# EAGLE design HP85disk (EAGLE 9.2.2)

## Sheet 1 of 2
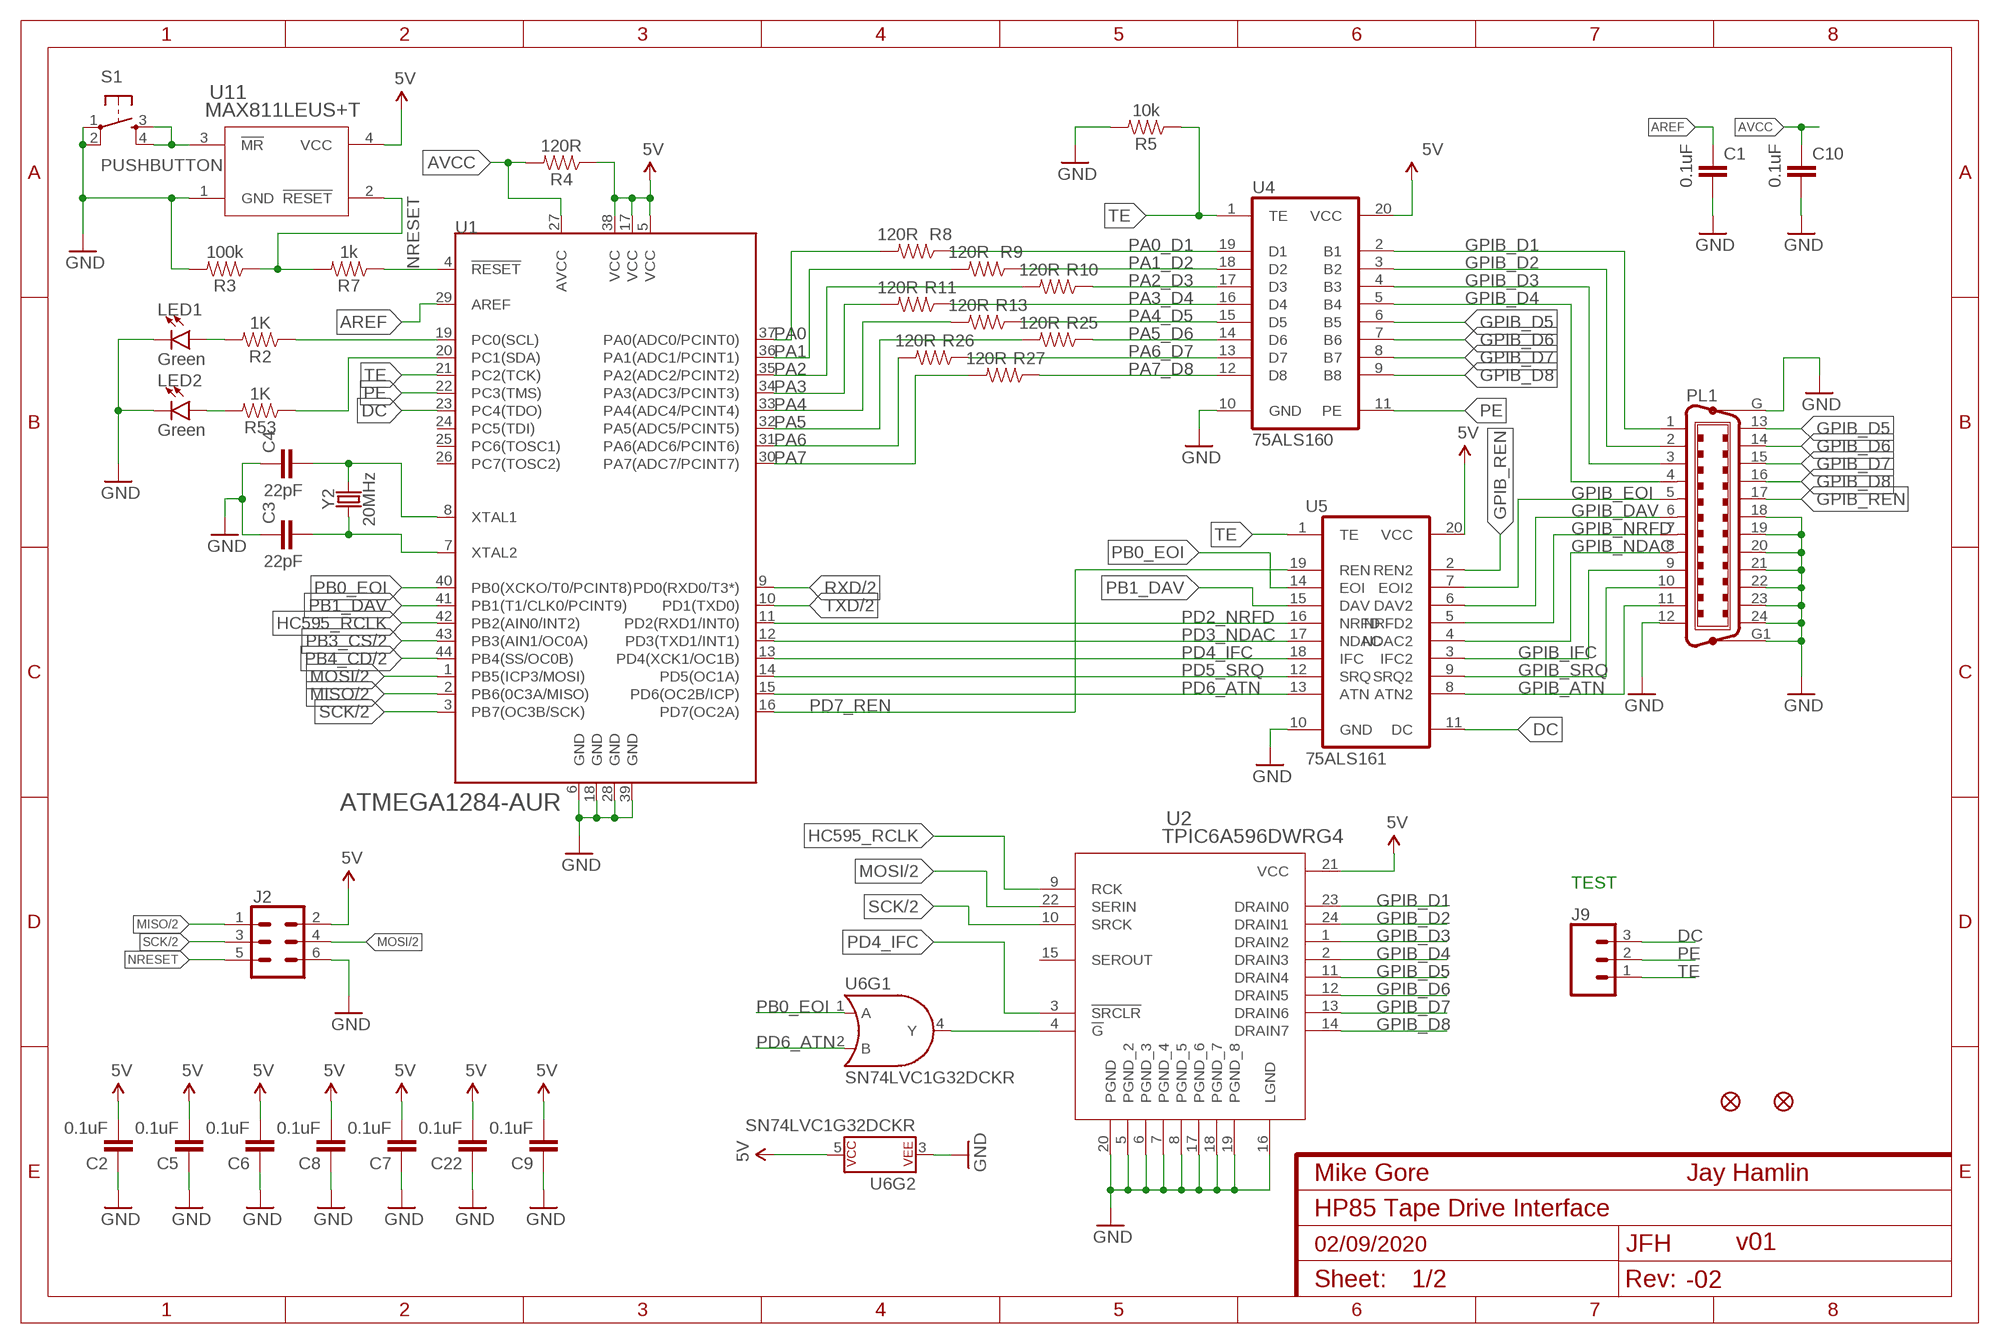
[diagram p0: schematic, sheet 1]

### Parts
C1  0.1uF  0.1UF-0603-25V-(+80/-20%)  [0603]
C2  0.1uF  0.1UF-0603-25V-(+80/-20%)  [0603]
C3  22pF  0.1UF-0603-25V-(+80/-20%)  [0603]
C4  22pF  0.1UF-0603-25V-(+80/-20%)  [0603]
C5  0.1uF  0.1UF-0603-25V-(+80/-20%)  [0603]
C6  0.1uF  0.1UF-0603-25V-(+80/-20%)  [0603]
C7  0.1uF  0.1UF-0603-25V-(+80/-20%)  [0603]
C8  0.1uF  0.1UF-0603-25V-(+80/-20%)  [0603]
C9  0.1uF  0.1UF-0603-25V-(+80/-20%)  [0603]
C10  0.1uF  0.1UF-0603-25V-(+80/-20%)  [0603]
C22  0.1uF  0.1UF-0603-25V-(+80/-20%)  [0603]
J2  CONN_03X2_BIGPADSFEMALE_SMD  [2X3_SMD]
J9  CONN_03  [1X03]
JP8  FIDUCIAL1X2  [FIDUCIAL-1X2]
JP9  FIDUCIAL1X2  [FIDUCIAL-1X2]
LED1  Green  LED1206  [LED-1206]
LED2  Green  LED1206  [LED-1206]
PL1  C24HP  [24HP]
R2  1K  4.7KOHM-0603-1/10W-1%  [0603]
R3  100k  10KOHM-0603-1/10W-1%  [0603]
R4  120R  10KOHM-0603-1/10W-1%  [0603]
R5  10k  10KOHM-0603-1/10W-1%  [0603]
R7  1k  10KOHM-0603-1/10W-1%  [0603]
R8  120R  10KOHM-0603-1/10W-1%  [0603]
R9  120R  10KOHM-0603-1/10W-1%  [0603]
R10  120R  10KOHM-0603-1/10W-1%  [0603]
R11  120R  10KOHM-0603-1/10W-1%  [0603]
R13  120R  10KOHM-0603-1/10W-1%  [0603]
R25  120R  10KOHM-0603-1/10W-1%  [0603]
R26  120R  10KOHM-0603-1/10W-1%  [0603]
R27  120R  10KOHM-0603-1/10W-1%  [0603]
R53  1K  4.7KOHM-0603-1/10W-1%  [0603]
S1  PUSHBUTTON  SWITCH_SPST_4_PINSQUARE  [TACTILE-SWITCH-SMD]
U1  ATMEGA1284-AUR  ATMEGA1284AUTQFP-44  [TQFP44]
U2  TPIC6A596DWRG4  [DW24]
U4  75ALS160  75160SO  [SO20L]
U5  75ALS161  75161SO  [SO20L]
U6  SN74LVC1G32DCKR  74LVC32DBV  [SOT23-5]
U11  MAX811LEUS+T  MAX811TEUS+T  [21-0052F]
Y2  20MHz  CRYSTAL-16MHZSMD-5X3.2  [CRYSTAL-SMD-5X3.2-4PAD]

### Nets
5V: C2.2 C5.2 C6.2 C7.2 C8.2 C9.2 C22.2 J2.2 R4.1 U1.5(VCC) U1.17(VCC) U1.38(VCC) U2.21(VCC) U4.20(VCC) U5.20(VCC) U6.5(P$V+) U11.4(VCC) ; also sheet 2
AREF: C1.1 U1.29(AREF)
AVCC: C10.1 R4.2 U1.27(AVCC)
DC: J9.3 U1.23(PC4(TDO)) U5.11(DC)
GND: C1.2 C2.1 C3.1 C4.1 C5.1 C6.1 C7.1 C8.1 C9.1 C10.2 C22.1 J2.6 LED1.C LED2.C PL1.12 PL1.18 PL1.19 PL1.20 PL1.21 PL1.22 PL1.23 PL1.24 PL1.G PL1.G1 R3.2 R5.2 S1.1 S1.2 U1.6(GND) U1.18(GND) U1.28(GND) U1.39(GND) U2.5(PGND_2) U2.6(PGND_3) U2.7(PGND_4) U2.8(PGND_5) U2.16(LGND) U2.17(PGND_6) U2.18(PGND_7) U2.19(PGND_8) U2.20(PGND) U4.10(GND) U5.10(GND) U6.3(P$V-) U11.1(GND) ; also sheet 2
GPIB_ATN: PL1.11 U5.8(ATN2)
GPIB_D1: PL1.1 U2.23(DRAIN0) U4.2(B1)
GPIB_D2: PL1.2 U2.24(DRAIN1) U4.3(B2)
GPIB_D3: PL1.3 U2.1(DRAIN2) U4.4(B3)
GPIB_D4: PL1.4 U2.2(DRAIN3) U4.5(B4)
GPIB_D5: PL1.13 U2.11(DRAIN4) U4.6(B5)
GPIB_D6: PL1.14 U2.12(DRAIN5) U4.7(B6)
GPIB_D7: PL1.15 U2.13(DRAIN6) U4.8(B7)
GPIB_D8: PL1.16 U2.14(DRAIN7) U4.9(B8)
GPIB_DAV: PL1.6 U5.6(DAV2)
GPIB_EOI: PL1.5 U5.7(EOI2)
GPIB_IFC: PL1.9 U5.3(IFC2)
GPIB_NDAC: PL1.8 U5.4(NDAC2)
GPIB_NRFD: PL1.7 U5.5(NRFD2)
GPIB_REN: PL1.17 U5.2(REN2)
GPIB_SRQ: PL1.10 U5.9(SRQ2)
HC595_RCLK: U1.42(PB2(AIN0/INT2)) U2.9(RCK)
MISO: J2.1 U1.2(PB6(0C3A/MISO)) ; also sheet 2
MOSI: J2.4 U1.1(PB5(ICP3/MOSI)) U2.22(SERIN) ; also sheet 2
N$2: R53.1 U1.20(PC1(SDA))
N$3: C4.2 U1.8(XTAL1) Y2.3
N$4: C3.2 U1.7(XTAL2) Y2.1
N$6: U2.4(!G) U6.4(Y)
N$8: S1.3 S1.4 U11.3(!MR)
N$12: R3.1 R7.2 U11.2(!RESET)
N$21: LED1.A R2.2
N$22: LED2.A R53.2
N$28: R2.1 U1.19(PC0(SCL))
NRESET: J2.5 R7.1 U1.4(!RESET)
PA0: R8.2 U1.37(PA0(ADC0/PCINT0))
PA0_D1: R8.1 U4.19(D1)
PA1: R9.2 U1.36(PA1(ADC1/PCINT1))
PA1_D2: R9.1 U4.18(D2)
PA2: R10.2 U1.35(PA2(ADC2/PCINT2))
PA2_D3: R10.1 U4.17(D3)
PA3: R11.2 U1.34(PA3(ADC3/PCINT3))
PA3_D4: R11.1 U4.16(D4)
PA4: R13.2 U1.33(PA4(ADC4/PCINT4))
PA4_D5: R13.1 U4.15(D5)
PA5: R25.2 U1.32(PA5(ADC5/PCINT5))
PA5_D6: R25.1 U4.14(D6)
PA6: R26.2 U1.31(PA6(ADC6/PCINT6))
PA6_D7: R26.1 U4.13(D7)
PA7: R27.2 U1.30(PA7(ADC7/PCINT7))
PA7_D8: R27.1 U4.12(D8)
PB0_EOI: U1.40(PB0(XCKO/T0/PCINT8)) U5.14(EOI) U6.1(A)
PB1_DAV: U1.41(PB1(T1/CLK0/PCINT9)) U5.15(DAV)
PB3_CS: U1.43(PB3(AIN1/OC0A)) ; also sheet 2
PB4_CD: U1.44(PB4(SS/OC0B)) ; also sheet 2
PD2_NRFD: U1.11(PD2(RXD1/INT0)) U5.16(NRFD)
PD3_NDAC: U1.12(PD3(TXD1/INT1)) U5.17(NDAC)
PD4_IFC: U1.13(PD4(XCK1/OC1B)) U2.3(!SRCLR) U5.18(IFC)
PD5_SRQ: U1.14(PD5(OC1A)) U5.12(SRQ)
PD6_ATN: U1.15(PD6(OC2B/ICP)) U5.13(ATN) U6.2(B)
PD7_REN: U1.16(PD7(OC2A)) U5.19(REN)
PE: J9.2 U1.22(PC3(TMS)) U4.11(PE)
RXD: U1.9(PD0(RXD0/T3*)) ; also sheet 2
SCK: J2.3 U1.3(PB7(OC3B/SCK)) U2.10(SRCK) ; also sheet 2
TE: J9.1 R5.1 U1.21(PC2(TCK)) U4.1(TE) U5.1(TE)
TXD: U1.10(PD1(TXD0)) ; also sheet 2
Unconnected: U1.24(PC5(TDI)) U1.25(PC6(TOSC1)) U1.26(PC7(TOSC2)) U2.15(SEROUT)

### Notes on the sheet
- TEST
- v01

## Sheet 2 of 2
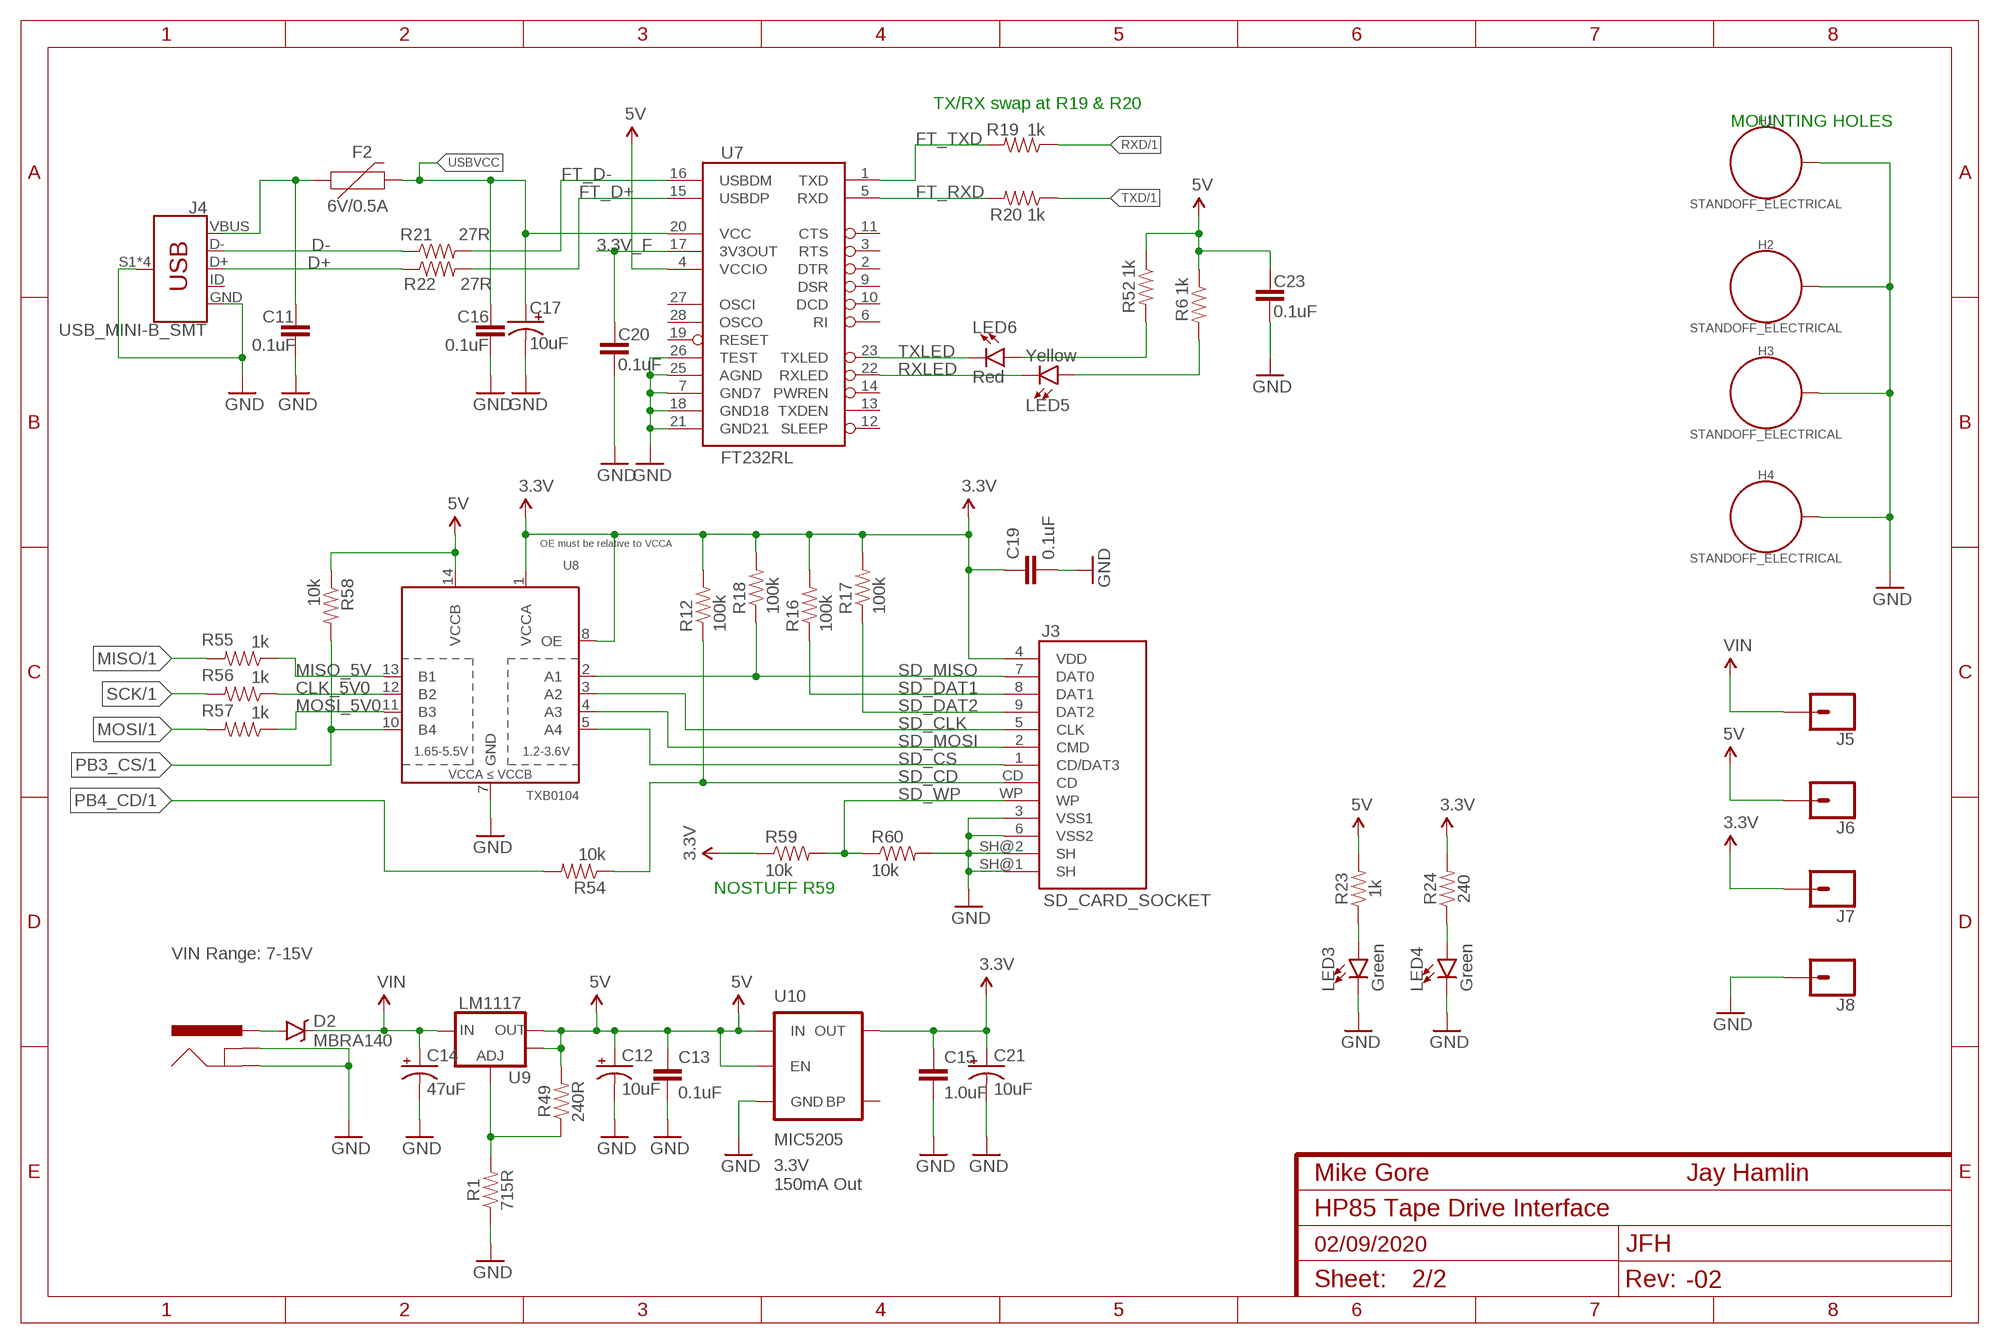
[diagram p1: schematic, sheet 2]

### Parts
C11  0.1uF  0.1UF-0603-25V-(+80/-20%)  [0603]
C12  10uF  10UF-POLAR-EIA3216-16V-10%(TANT)  [EIA3216]
C13  0.1uF  0.1UF-0603-25V-(+80/-20%)  [0603]
C14  47uF  47UF-POLAR-PANASONIC_D-35V-20%  [PANASONIC_D]
C15  1.0uF  1.0UF-0603-16V-10%  [0603]
C16  0.1uF  0.1UF-0603-25V-(+80/-20%)  [0603]
C17  10uF  10UF-POLAR-EIA3216-16V-10%(TANT)  [EIA3216]
C19  0.1uF  0.1UF-0603-25V-(+80/-20%)  [0603]
C20  0.1uF  0.1UF-0603-25V-(+80/-20%)  [0603]
C21  10uF  10UF-POLAR-EIA3216-16V-10%(TANT)  [EIA3216]
C23  0.1uF  0.1UF-0603-25V-(+80/-20%)  [0603]
D2  MBRA140  [SMA-DIODE]
F2  6V/0.5A  PTC-HALF_AMP  [1206]
H1  STANDOFF_ELECTRICAL  [STANDOFF-ELECTRICAL]
H2  STANDOFF_ELECTRICAL  [STANDOFF-ELECTRICAL]
H3  STANDOFF_ELECTRICAL  [STANDOFF-ELECTRICAL]
H4  STANDOFF_ELECTRICAL  [STANDOFF-ELECTRICAL]
J1  POWER_JACKSUPER_BOMB_DIGITY  [POWER_JACK_SMD_OVERPASTE_SUPER_BOMB_DIGITY]
J3  SD_CARD_SOCKET  [SD_1:1]
J4  USB_MINI-B_SMT  [USB-MINIB]
J5  CONN_01  [1X01]
J6  CONN_01  [1X01]
J7  CONN_01  [1X01]
J8  CONN_01  [1X01]
LED3  Green  LED1206  [LED-1206]
LED4  Green  LED1206  [LED-1206]
LED5  Yellow  LED1206  [LED-1206]
LED6  Red  LED1206  [LED-1206]
R1  715R  715OHM-0603-1/10W-1%  [0603]
R6  1k  1KOHM-0603-1/10W-1%  [0603]
R12  100k  100KOHM-1/10W-1%(0603)  [0603-RES]
R16  100k  100KOHM-1/10W-1%(0603)  [0603-RES]
R17  100k  100KOHM-1/10W-1%(0603)  [0603-RES]
R18  100k  100KOHM-1/10W-1%(0603)  [0603-RES]
R19  1k  1KOHM-0603-1/10W-1%  [0603]
R20  1k  1KOHM-0603-1/10W-1%  [0603]
R21  27R  27OHM-0603-1/10W-1%  [0603]
R22  27R  27OHM-0603-1/10W-1%  [0603]
R23  1k  4.7KOHM-0603-1/10W-1%  [0603]
R24  240  4.7KOHM-0603-1/10W-1%  [0603]
R49  240R  240OHM-0603-1/10W-1%  [0603]
R52  1k  1KOHM-0603-1/10W-1%  [0603]
R54  10k  100KOHM-1/10W-1%(0603)  [0603-RES]
R55  1k  100KOHM-1/10W-1%(0603)  [0603-RES]
R56  1k  100KOHM-1/10W-1%(0603)  [0603-RES]
R57  1k  100KOHM-1/10W-1%(0603)  [0603-RES]
R58  10k  100KOHM-1/10W-1%(0603)  [0603-RES]
R59  10k  100KOHM-1/10W-1%(0603)  [0603-RES]
R60  10k  100KOHM-1/10W-1%(0603)  [0603-RES]
U7  FT232RL  FT232RLSSOP  [SSOP28DB]
U8  TXB0104  TXB0104PWRSOIC14  [SO14]
U9  LM1117  V_REG_LM1117ALT1  [SOT223-ALT1]
U10  MIC5205  MIC52053.3V  [SOT23-5]

### Nets
3.3V: C15.1 C19.1 C21.+ J3.4(VDD) J7.1 R12.2 R16.2 R17.2 R18.2 R24.2 R59.1 U8.1(VCCA) U8.8(OE) U10.5(OUT)
3.3V_F: C20.1 U7.17(3V3OUT)
5V: C12.+ C13.1 C23.1 J6.1 R6.1 R23.2 R49.2 R52.1 R58.1 U7.4(VCCIO) U8.14(VCCB) U9.2(OUT) U9.4(OUT) U10.1(IN) U10.3(EN) ; also sheet 1
CLK_5V0: R56.1 U8.12(B2)
D+: J4.D+ R22.1
D-: J4.D- R21.1
FT_D+: R22.2 U7.15(USBDP)
FT_D-: R21.2 U7.16(USBDM)
FT_RXD: R20.2 U7.5(RXD)
FT_TXD: R19.2 U7.1(TXD)
GND: C11.2 C12.- C13.2 C14.- C15.2 C16.2 C17.- C19.2 C20.2 C21.- C23.2 H1.P1 H2.P1 H3.P1 H4.P1 J1.GND(GNDBREAK) J1.P$4(GND) J3.3(VSS1) J3.6(VSS2) J3.SH@1(SH) J3.SH@2(SH) J4.GND J4.S1(SHIELD) J4.S2(SHIELD) J4.S3(SHIELD) J4.S4(SHIELD) J8.1 LED3.C LED4.C R1.1 R60.2 U7.7(GND7) U7.18(GND18) U7.21(GND21) U7.25(AGND) U7.26(TEST) U8.7(GND) U10.2(GND) ; also sheet 1
MISO: R55.2 ; also sheet 1
MISO_5V: R55.1 U8.13(B1)
MOSI: R57.2 ; also sheet 1
MOSI_5V0: R57.1 U8.11(B3)
N$1: R1.2 R49.1 U9.1(ADJ)
N$5: LED6.A R52.2
N$7: LED3.A R23.1
N$9: LED5.A R6.2
N$19: LED4.A R24.1
PB3_CS: R58.2 U8.10(B4) ; also sheet 1
PB4_CD: R54.2 ; also sheet 1
PWRIN1: D2.A J1.VIN0(PWR)
RXD: R19.1 ; also sheet 1
RXLED: LED5.C U7.22(RXLED)
SCK: R56.2 ; also sheet 1
SD_CD: J3.CD R12.1 R54.1
SD_CLK: J3.5(CLK) U8.3(A2)
SD_CS: J3.1(CD/DAT3) U8.5(A4)
SD_DAT1: J3.8(DAT1) R16.1
SD_DAT2: J3.9(DAT2) R17.1
SD_MISO: J3.7(DAT0) R18.1 U8.2(A1)
SD_MOSI: J3.2(CMD) U8.4(A3)
SD_WP: J3.WP R59.2 R60.1
TXD: R20.1 ; also sheet 1
TXLED: LED6.C U7.23(TXLED)
USBVCC: C16.1 C17.+ F2.2 U7.20(VCC)
VIN: C14.+ D2.C J5.1 U9.3(IN)
VUSB1: C11.1 F2.1 J4.VBUS
Unconnected: J4.ID U7.2(DTR) U7.3(RTS) U7.6(RI) U7.9(DSR) U7.10(DCD) U7.11(CTS) U7.12(SLEEP) U7.13(TXDEN) U7.14(PWREN) U7.19(RESET) U7.27(OSCI) U7.28(OSCO) U10.4(BP)

### Notes on the sheet
- TX/RX swap at R19 & R20
- MOUNTING HOLES
- OE must be relative to VCCA
- NOSTUFF R59
- VIN Range: 7-15V
- 3.3V
  150mA Out

## Library data of the parts
C1 C9-C11 C13 C16 C19 C20 C22 C23 = SparkFun-Capacitors:0.1UF: 0.1µF ceramic capacitors A capacitor is a passive two-terminal electrical component used to store electrical energy temporarily in an electric field.; PROD_ID: CAP-00810
C2 C5-C8 = SparkFun-Capacitors:0.1UF: 0.1µF ceramic capacitors A capacitor is a passive two-terminal electrical component used to store electrical energy temporarily in an electric field.; PROD_ID: CAP-00810; SPICEPREFIX: C
C3 C4 = SparkFun-Capacitors:0.1UF: 0.1µF ceramic capacitors A capacitor is a passive two-terminal electrical component used to store electrical energy temporarily in an electric field.; PROD_ID: CAP-00810; VALUE: 0.1uF
C12 C17 C21 = SparkFun-Capacitors:10UF-POLAR: 10.0µF polarized capacitors A capacitor is a passive two-terminal electrical component used to store electrical energy temporarily in an electric field.; PROD_ID: CAP-00811
C14 = SparkFun-Capacitors:47UF-POLAR: 47µF polarized capacitors A capacitor is a passive two-terminal electrical component used to store electrical energy temporarily in an electric field.; PROD_ID: CAP-08478
C15 = SparkFun-Capacitors:1.0UF: 1µF ceramic capacitors A capacitor is a passive two-terminal electrical component used to store electrical energy temporarily in an electric field.; PROD_ID: CAP-00868
D2 = SparkFun-DiscreteSemi:MBRA140: 40V, 1A Schottky rectifier SMA/DO-214AC package DIO-08053; PROD_ID: DIO-08053
F2 = SparkFun-Fuses:PTC: Resettable Fuse PTC Resettable Fuse. Really a resistor with a postive temperature coefficient who's resistance increases dramatically with an increase in temperature. When heated by the power passing through the resistance rises causing the current to be limited, protecting the circuit. When a PTC cools back down it resumes conducting letting the circuit turn back on.; PROD_ID: RES-08585
H1-H4 = SparkFun-Hardware:STANDOFF_ELECTRICAL: Stand Off Drill holes with an electrical connection. For example, use these to ground your board to a chassis. Example SparkFun Products Screw - Phillips Head (1/4", 4-40, 10 pack) <https://www.sparkfun.com/products/10453> (PRT-10453) Screw - Phillips Head (1/2", 4-40, 10 pack) <https://www.sparkfun.com/products/10452> (PRT-10452) Screw - Phillips Head (3/4", 4-40, 10 pack) <https://www.sparkfun.com/products/10451> (PRT-10451) Screw - Phillips Head (1", 4-40, 10 pack) <https://www.sparkfun.com/products/10450> (PRT-10450)
J1 = Testing:POWER_JACK: Power Jack This is the standard 5.5mm barrel jack for power. The PTH is the most common, proven, reliable, footprint. All others are experimental. The Slot footprint only works if the mill layer is transmitted to the PCB fab house so be warned. Spark Fun Electronics SKU : PRT-00119. Mating wall wart : TOL-00298 (and others); PROD_ID: CONN-08106
J2 = JaysOWL_Library:CONN_03X2_BIGPADS: Multi connection point. Often used as Generic Header-pin footprint for 0.1 inch spaced/style header connections You can populate with any combo of single row headers, but if you'd like an exact match, check these: Header - 2x3 (Male, 0.1") <https://www.sparkfun.com/products/12807> (PRT-12807) Header - 2x3 (Female, 0.1") <https://www.sparkfun.com/products/13010> (PRT-13010) 2x3 Pin Shrouded Header <https://www.sparkfun.com/products/10877> (PRT-10877) On any of the 0.1 inch spaced packages, you can populate with these: Break Away Headers - Straight <https://www.sparkfun.com/products/116> (PRT-00116) Break Away Male Headers - Right Angle <https://www.sparkfun.com/products/553> (PRT-00553) Female Headers <https://www.sparkfun.com/products/115> (PRT-00115) Break Away Headers - Machine Pin <https://www.sparkfun.com/products/117> (PRT-00117) Break Away Female Headers - Swiss Machine Pin <https://www.sparkfun.com/products/743> (PRT-00743) Special note: the shrouded connector mates well with our 3x2 ribbon cables: Ribbon Crimp Connector - 6-pin (2x3, Female) <https://www.sparkfun.com/products/10651> (PRT-10651) Ribbon Cable - 6 wire (15ft) <https://www.sparkfun.com/products/10646> (PRT-10646); PROD_ID: CONN-11290
J3 = SparkFun-Connectors:SD_CARD_SOCKET: SD Memory Card Connector, push-push normal type, CD enable, WP enable
J4 = JaysOWL_Library:USB_MINI-B: USB type Mini-B Connector Breaks out 5th pin, and includes shield pins if needed. SparkFun Products: SparkFun FTDI Basic Breakout <https://www.sparkfun.com/products/9716> SparkFun XBee Explorer USB <https://www.sparkfun.com/products/11812> SparkFun Redboard <https://www.sparkfun.com/products/12757>; PROD_ID: CONN-08193; SF_ID: PRT-00587
J5-J8 = SparkFun-Connectors:CONN_01: Single connection point. Often used as Generic Header-pin footprint for 0.1 inch spaced/style header connections On any of the 0.1 inch spaced packages, you can populate with these: Break Away Headers - Straight <https://www.sparkfun.com/products/116> (PRT-00116) Break Away Male Headers - Right Angle <https://www.sparkfun.com/products/553> (PRT-00553) Female Headers <https://www.sparkfun.com/products/115> (PRT-00115) Break Away Headers - Machine Pin <https://www.sparkfun.com/products/117> (PRT-00117) Break Away Female Headers - Swiss Machine Pin <https://www.sparkfun.com/products/743> (PRT-00743) This device is also useful as a general connection point to wire up your design to another part of your project. Our various solder wires solder well into these plated through hole pads. Hook-Up Wire - Assortment (Stranded, 22 AWG) <https://www.sparkfun.com/products/11375> (PRT-11375) Hook-Up Wire - Assortment (Solid Core, 22 AWG) <https://www.sparkfun.com/products/11367> (PRT-11367) View the entire wire category on our website here <https://www.sparkfun.com/categories/141> Special notes: SMTSO-256-ET is a "flush mount" nut for a 4-40 screw. We mostly use this on specialty testbeds; it is a nice way to connect hardware to your PCB at an adjustable hieght. Also note, the SNAP packages are for using a snappable style connector. We sell a baggie of snaps and they are also used on two LilyPad designs: Snap Assortment - 30 pack (male and female) <https://www.sparkfun.com/products/11347> (DEV-11347) LilyPad Arduino SimpleSnap <https://www.sparkfun.com/products/10941> (DEV-10941) LilyPad SimpleSnap Protoboard <https://www.sparkfun.com/products/10940> (DEV-10940)
J9 = SparkFun-Connectors:CONN_03: Multi connection point. Often used as Generic Header-pin footprint for 0.1 inch spaced/style header connections On any of the 0.1 inch spaced packages, you can populate with these: Break Away Headers - Straight <https://www.sparkfun.com/products/116> (PRT-00116) Break Away Male Headers - Right Angle <https://www.sparkfun.com/products/553> (PRT-00553) Female Headers <https://www.sparkfun.com/products/115> (PRT-00115) Break Away Headers - Machine Pin <https://www.sparkfun.com/products/117> (PRT-00117) Break Away Female Headers - Swiss Machine Pin <https://www.sparkfun.com/products/743> (PRT-00743) Stackable Header - 3 Pin (Female, 0.1") <https://www.sparkfun.com/products/13875> (PRT-13875) For SCREWTERMINALS and SPRING TERMINALS visit here: Screw Terimnals on SparkFun.com <https://www.sparkfun.com/search/results?term=Screw+Terminals> (5mm/3.5mm/2.54mm spacing) This device is also useful as a general connection point to wire up your design to another part of your project. Our various solder wires solder well into these plated through hole pads. Hook-Up Wire - Assortment (Stranded, 22 AWG) <https://www.sparkfun.com/products/11375> (PRT-11375) Hook-Up Wire - Assortment (Solid Core, 22 AWG) <https://www.sparkfun.com/products/11367> (PRT-11367) View the entire wire category on our website here <https://www.sparkfun.com/categories/141> Special notes: Molex polarized connector foot print use with SKU : PRT-08232 with associated crimp pins and housings.
JP8 JP9 = SparkFun:FIDUCIAL: Fiducial Alignment Points Various fiducial points for machine vision alignment.
LED1-LED4 = SparkFun-LED:LED: LED (Generic) Standard schematic elements and footprints for 5mm, 3mm, 1206, and 0603 sized LEDs. Generic LEDs with no color specified.; PROD_ID: DIO-09910
LED5 = SparkFun-LED:LED: LED (Generic) Standard schematic elements and footprints for 5mm, 3mm, 1206, and 0603 sized LEDs. Generic LEDs with no color specified.; PROD_ID: DIO-09909
LED6 = SparkFun-LED:LED: LED (Generic) Standard schematic elements and footprints for 5mm, 3mm, 1206, and 0603 sized LEDs. Generic LEDs with no color specified.; PROD_ID: DIO-09912
PL1 = con-amp-champ:C24HP: CONNECTOR; OC_FARNELL: unknown; OC_NEWARK: unknown
R1 = SparkFun-Resistors:715OHM: 715Ω resistor A resistor is a passive two-terminal electrical component that implements electrical resistance as a circuit element. Resistors act to reduce current flow, and, at the same time, act to lower voltage levels within circuits.; PROD_ID: RES-07850; VALUE: 715
R2 R23 R24 R53 = SparkFun-Resistors:4.7KOHM: 4.7kΩ resistor A resistor is a passive two-terminal electrical component that implements electrical resistance as a circuit element. Resistors act to reduce current flow, and, at the same time, act to lower voltage levels within circuits.; PROD_ID: RES-07857; VALUE: 4.7k
R3 R4 R7-R11 R13 R25-R27 = SparkFun-Resistors:10KOHM: 10kΩ resistor A resistor is a passive two-terminal electrical component that implements electrical resistance as a circuit element. Resistors act to reduce current flow, and, at the same time, act to lower voltage levels within circuits.; PROD_ID: RES-00824; VALUE: 10k
R5 = SparkFun-Resistors:10KOHM: 10kΩ resistor A resistor is a passive two-terminal electrical component that implements electrical resistance as a circuit element. Resistors act to reduce current flow, and, at the same time, act to lower voltage levels within circuits.; PROD_ID: RES-00824
R6 R19 R20 R52 = SparkFun-Resistors:1KOHM: 1kΩ resistor A resistor is a passive two-terminal electrical component that implements electrical resistance as a circuit element. Resistors act to reduce current flow, and, at the same time, act to lower voltage levels within circuits.; PROD_ID: RES-07856
R12 R16-R18 = SparkFun-Resistors:100KOHM-1/10W-1%(0603): RES-07828; PROD_ID: RES-07828
R21 R22 = SparkFun-Resistors:27OHM: 27Ω resistor A resistor is a passive two-terminal electrical component that implements electrical resistance as a circuit element. Resistors act to reduce current flow, and, at the same time, act to lower voltage levels within circuits.; PROD_ID: RES-09334; VALUE: 27
R49 = SparkFun-Resistors:240OHM: 240Ω resistor A resistor is a passive two-terminal electrical component that implements electrical resistance as a circuit element. Resistors act to reduce current flow, and, at the same time, act to lower voltage levels within circuits.; PROD_ID: RES-07849; VALUE: 240
R54-R60 = SparkFun-Resistors:100KOHM-1/10W-1%(0603): RES-07828; PROD_ID: RES-07828; VALUE: 100k
S1 = SparkFun-Electromechanical:SWITCH_SPST_4_PIN; PROD_ID: SWCH-08247
U1 = JaysOWL_Library:ATMEGA1284AU: ATMega1284 AU; PROD_ID: IC-11161; VALUE: 32U4
U2 = JaysOWL_Library:TPIC6A596DWRG4; BUILT_BY: EMA_UL_Team; MANUFACTURER: Texas Instruments; MANUFACTURER_PART_NUMBER: TPIC6A596DWRG4; VENDOR: Texas Instruments
U4 = JaysOWL_Library:75160: 75xxx DEVICE
U5 = JaysOWL_Library:75161: 75xxx DEVICE
U6 = JaysOWL_Library:74*32: Single OR gate IC POSITIVE-OR GATE 2-IN SC-70 SparkFun Products SparkFun Stepoko <https://www.sparkfun.com/products/13899> (ROB-13899) SparkFun LogicBlocks Kit <https://www.sparkfun.com/products/11006> (KIT-11006); PROD_ID: IC-10842
U7 = SparkFun-IC-Comms:FT232RL: FT232RL USB UART FT232RL 4th Generation USB UART (USB <-> Serial) Controller. Datasheet <http://www.sparkfun.com/datasheets/IC/FT232R_v104.pdf> SparkFun Products Component <https://www.sparkfun.com/products/650> (COM-00650) SparkFun RedBot Mainboard <https://www.sparkfun.com/products/12097> (ROB-12097) SparkFun FTDI Basic Breakout - 5V <https://www.sparkfun.com/products/9716> (DEV-09716) SparkFun FTDI Basic Breakout - 3.3V <https://www.sparkfun.com/products/9873> (DEV-09873) Bus Pirate - v3.6a <https://www.sparkfun.com/products/12942> (TOL-12942) SparkFun USB to Serial Breakout - FT232RL <https://www.sparkfun.com/products/12731> (BOB-12731) SparkFun PicoBoard <https://www.sparkfun.com/products/11888> (WIG-11888) SparkFun RFID USB Reader <https://www.sparkfun.com/products/9963> (SEN-09963) LilyPad FTDI Basic Breakout - 5V <https://www.sparkfun.com/products/10275> (DEV-10275) SparkFun Stepoko <https://www.sparkfun.com/products/13899> (ROB-13899); PROD_ID: IC-00870
U8 = SparkFun-DigitalIC:TXB0104PWR: 4-Bit Bi-Directional Level Shifter 1.2V-3.6V (VCCA) to 1.65V-5.5V (VCCB) bi-directional level shifter with auto direction sensing. Max data rate - VCCA 1.8V: 20Mbps (50ns), VCCA 3.3V: 100Mbps (10ns) Digikey: 296-21929-1-ND (TSSOP) IC-11329; PROD_ID: IC-11329
U9 = Testing:V_REG_LM1117: Voltage Regulator LM1117 Standard adjustable voltage regulator but in SMD form. Spark Fun Electronics SKU : COM-00595; PROD_ID: VREG-08170
U10 = SparkFun-PowerIC:MIC5205: MIC5205 150mA vreg 3.3V - VREG-00822 5V - VREG-00823; PROD_ID: VREG-00822
U11 = JaysOWL_Library:MAX811TEUS+T; BUILT_BY: EMA_UL_Team; COPYRIGHT: Copyright (C) 2018 Accelerated Designs. All rights reserved; MANUFACTURER_PART_NUMBER: MAX811TEUS+T; VENDOR: Maxim Integrated Products
Y2 = SparkFun-Clocks:CRYSTAL-16MHZ: 16MHz Crystal Digikey Example <http://www.digikey.com/product-search/en?keywords=535-9122-1-ND> Frequency: 16MHz Frequency Stability: ±50ppm Frequency Tolerance: ±20ppm Load Capacitance: 18pF SparkFun Products: Pro Micro -5V/16MHz <https://www.sparkfun.com/products/12640> SparkFun Serial Enabled LCD Kit <https://www.sparkfun.com/products/10097>; PROD_ID: XTAL-08218; SF_ID: COM-00094; VALUE: 16MHz

## Net classes
0 default: width 0.102 mm, drill 0.305 mm, clearance 0.102 mm

## Board
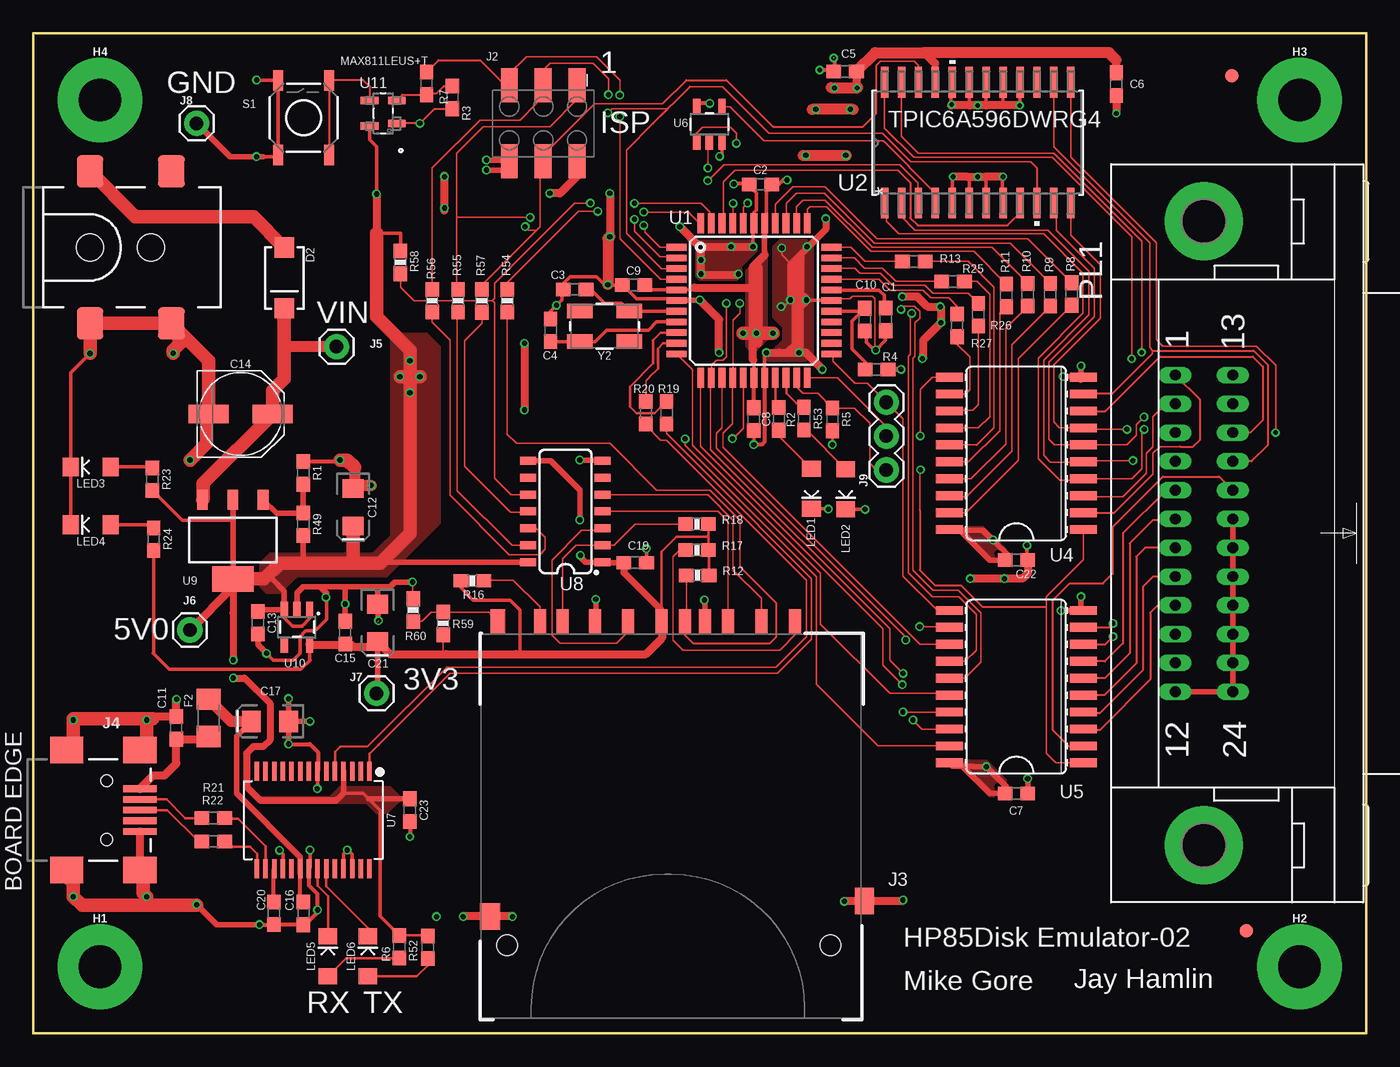
[diagram p2: board, top side]
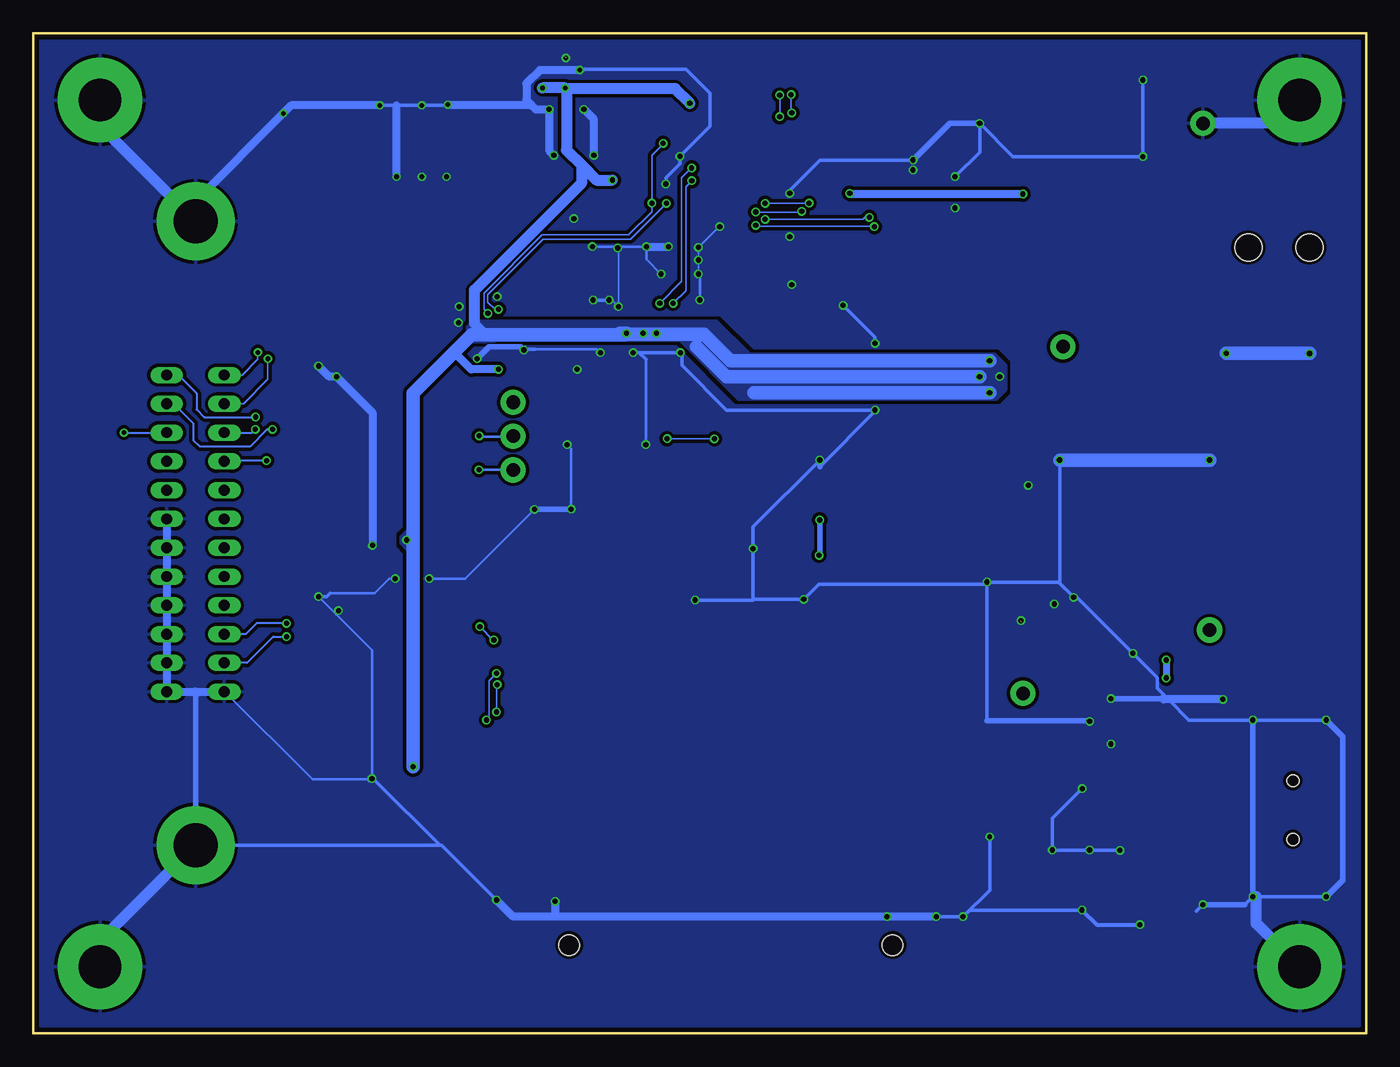
[diagram p3: board, bottom side, seen from below]

Size 100 x 75 mm. Coordinates in mm from the lower left corner, seen from the top.
Outline: 0,75 100,75 100,0 0,0 0,75
Copper layers (1*16): Top 0.035mm / dielectric 1.5mm / Bottom 0.035mm
Design rules "SparkFun-2-layer-FAB-LIMIT": minimum track width 4mil, minimum drill 6mil, track to track 4mil, track to pad 4mil, pad to pad 4mil, via to via 4mil, smd to smd 4mil, copper to edge 4mil, drill to drill 4mil, minimum pad ring 5mil, minimum via ring 5mil, stop-mask expansion 4mil, vias tented up to drill 25mil, thermal gap 10mil
vRestrict: area 0.6,22.4 to 2,30.6; area 5.7,23.1 to 7.4,30.6; area 47.9,10.8 to 48.5,11.3; area 50.4,10.7 to 50.9,11.6; area 11.3,29.3 to 12.7,31.6; area 0.3,13 to 9.4,25

### Footprints (pad centres in the part's own frame; a part is rotated, then mirrored left to right if it is on the bottom)
0603 = smd 1.1 x 1: 1 -0.85,0; 2 0.85,0
EIA3216 = smd 1.4 x 1.6: + 1.4,0; - -1.4,0
PANASONIC_D = smd 3 x 1.4: + 2.4,0; - -2.4,0
SMA-DIODE = smd 1.524 x 1.47: A -2.277,0; C 2.277,0
1206 = smd 1.6 x 1.8: 1 -1.4,0; 2 1.4,0
STANDOFF-ELECTRICAL = drill 3.2 pad 6.35: P1 0,0
POWER_JACK_SMD_OVERPASTE_SUPER_BOMB_DIGITY = smd 2 x 2.4: GND 0,-5.7; P$4 6.1,-5.7; VIN0 0,5.7; VIN1 6.1,5.7 | hole 2.032: 0,0; 4.572,0
2X3_SMD = smd 1.27 x 2.54: 1 -2.54,-2.85; 2 -2.54,2.85; 3 0,-2.85; 4 0,2.85; 5 2.54,-2.85; 6 2.54,2.85
SD_1:1 = smd 1.8 x 0.9: 1 -1,6.77; 2 -1,4.27; 3 -1,2.52; 4 -1,-0.73; 5 -1,-3.23; 6 -1,-5.73; 7 -1,-8.15; 8 -1,-9.85; 9 -1,9.27; CD -1,1.02 | smd 2 x 1.4: SH@1 20,14.496 | smd 2 x 1.527: SH@2 21.15,-13.589 | smd 1.8 x 1.1: WP -1,-13 | hole 1.55: 23.3,11.94; 23.3,-12.32
USB-MINIB = smd 2.5 x 0.5: D+ 2.5,0; D- 2.5,0.8; GND 2.5,-1.6; ID 2.5,-0.8; VBUS 2.5,1.6 | smd 2.5 x 2: S1 -3,4.5; S2 2.5,4.5; S3 -3,-4.5; S4 2.5,-4.5 | hole 0.9: 0,2.2; 0,-2.2
1X01 = drill 1.016 pad 1.88: 1 0,0
1X03 = drill 1.016 pad 1.88: 1 0,0; 2 2.54,0; 3 5.08,0
FIDUCIAL-1X2 = smd 1 x 1: 1 0,0
LED-1206 = smd 1.2 x 1.4: A -1.5,0; C 1.5,0
24HP = drill 0.813 long: 1 -11.874,-2.159; 2 -9.716,-2.159; 3 -7.556,-2.159; 4 -5.397,-2.159; 5 -3.239,-2.159; 6 -1.079,-2.159; 7 1.079,-2.159; 8 3.239,-2.159; 9 5.397,-2.159; 10 7.556,-2.159; 11 9.716,-2.159; 12 11.874,-2.159; 13 -11.874,2.159; 14 -9.716,2.159; 15 -7.556,2.159; 16 -5.397,2.159; 17 -3.239,2.159; 18 -1.079,2.159; 19 1.079,2.159; 20 3.239,2.159; 21 5.397,2.159; 22 7.556,2.159; 23 9.716,2.159; 24 11.874,2.159 | drill 3.302 pad 5.842: G -23.393,0; G1 23.393,0
0603-RES = smd 1.1 x 1: 1 -0.85,0; 2 0.85,0
TACTILE-SWITCH-SMD = smd 1.524 x 0.762: 1 -2.794,1.905; 2 2.794,1.905; 3 -2.794,-1.905; 4 2.794,-1.905
TQFP44 = smd 1.5 x 0.5: 1 -5.8,4; 2 -5.8,3.2; 3 -5.8,2.4; 4 -5.8,1.6; 5 -5.8,0.8; 6 -5.8,0; 7 -5.8,-0.8; 8 -5.8,-1.6; 9 -5.8,-2.4; 10 -5.8,-3.2; 11 -5.8,-4; 23 5.8,-4; 24 5.8,-3.2; 25 5.8,-2.4; 26 5.8,-1.6; 27 5.8,-0.8; 28 5.8,0; 29 5.8,0.8; 30 5.8,1.6; 31 5.8,2.4; 32 5.8,3.2; 33 5.8,4 | smd 0.5 x 1.5: 12 -4,-5.8; 13 -3.2,-5.8; 14 -2.4,-5.8; 15 -1.6,-5.8; 16 -0.8,-5.8; 17 0,-5.8; 18 0.8,-5.8; 19 1.6,-5.8; 20 2.4,-5.8; 21 3.2,-5.8; 22 4,-5.8; 34 4,5.8; 35 3.2,5.8; 36 2.4,5.8; 37 1.6,5.8; 38 0.8,5.8; 39 0,5.8; 40 -0.8,5.8; 41 -1.6,5.8; 42 -2.4,5.8; 43 -3.2,5.8; 44 -4,5.8
DW24 = smd 2.311 x 0.559: 1 -4.521,6.985; 2 -4.521,5.715; 3 -4.521,4.445; 4 -4.521,3.175; 5 -4.521,1.905; 6 -4.521,0.635; 7 -4.521,-0.635; 8 -4.521,-1.905; 9 -4.521,-3.175; 10 -4.521,-4.445; 11 -4.521,-5.715; 12 -4.521,-6.985; 13 4.521,-6.985; 14 4.521,-5.715; 15 4.521,-4.445; 16 4.521,-3.175; 17 4.521,-1.905; 18 4.521,-0.635; 19 4.521,0.635; 20 4.521,1.905; 21 4.521,3.175; 22 4.521,4.445; 23 4.521,5.715; 24 4.521,6.985
SO20L = smd 0.66 x 2.032: 1 -5.715,-5.029; 2 -4.445,-5.029; 3 -3.175,-5.029; 4 -1.905,-5.029; 5 -0.635,-5.029; 6 0.635,-5.029; 7 1.905,-5.029; 8 3.175,-5.029; 9 4.445,-5.029; 10 5.715,-5.029; 11 5.715,5.029; 12 4.445,5.029; 13 3.175,5.029; 14 1.905,5.029; 15 0.635,5.029; 16 -0.635,5.029; 17 -1.905,5.029; 18 -3.175,5.029; 19 -4.445,5.029; 20 -5.715,5.029
SOT23-5 = smd 0.55 x 1.2: 1 -0.95,-1.3; 2 0,-1.3; 3 0.95,-1.3; 4 0.95,1.3; 5 -0.95,1.3
SSOP28DB = smd 0.348 x 1.397: 1 -4.225,-3.656; 2 -3.575,-3.656; 3 -2.925,-3.656; 4 -2.275,-3.656; 5 -1.625,-3.656; 6 -0.975,-3.656; 7 -0.325,-3.656; 8 0.325,-3.656; 9 0.975,-3.656; 10 1.625,-3.656; 11 2.275,-3.656; 12 2.925,-3.656; 13 3.575,-3.656; 14 4.225,-3.656; 15 4.225,3.656; 16 3.575,3.656; 17 2.925,3.656; 18 2.275,3.656; 19 1.625,3.656; 20 0.975,3.656; 21 0.325,3.656; 22 -0.325,3.656; 23 -0.975,3.656; 24 -1.625,3.656; 25 -2.275,3.656; 26 -2.925,3.656; 27 -3.575,3.656; 28 -4.225,3.656
SO14 = smd 0.6 x 1.2: 1 -3.81,-2.8; 2 -2.54,-2.8; 3 -1.27,-2.8; 4 0,-2.8; 5 1.27,-2.8; 6 2.54,-2.8; 7 3.81,-2.8; 8 3.81,2.8; 9 2.54,2.8; 10 1.27,2.8; 11 0,2.8; 12 -1.27,2.8; 13 -2.54,2.8; 14 -3.81,2.8
SOT223-ALT1 = smd 0.813 x 1.524: 1 -2.271,-3.02; 2 0,-3.02; 3 2.288,-3.02 | smd 3.124 x 1.905: 4 0,2.921
21-0052F = smd 0.559 x 1.321: 1 -0.775,-1.016; 2 0.965,-1.016; 3 0.965,1.016; 4 -0.965,1.016
CRYSTAL-SMD-5X3.2-4PAD = smd 1.9 x 1.1: 1 -1.85,-1.15; 2 1.85,-1.15; 3 1.85,1.15; 4 -1.85,1.15

### Placement (x,y rotation side)
C1  63.94,53.54 270 top
C2  54.56,63.67 0 top
C3  40.62,55.8 0 top
C4  38.81,52.73 270 top
C5  60.91,72.14 0 top
C6  81.25,71.19 90 top
C7  73.75,18 180 top
C8  54.06,46.07 90 top
C9  45.03,56.12 0 top
C10  62.37,53.53 270 top
C11  10.73,22.91 90 top
C12  23.99,39.46 270 top
C13  16.85,30.79 270 top
C14  15.55,46.45 0 top
C15  23.4,30.06 90 top
C16  20.27,8.99 270 top
C17  17.76,23.4 180 top
C19  45.15,35.3 0 top
C20  18.04,9.01 270 top
C21  25.83,30.78 270 top
C22  73.75,35.5 180 top
C23  28.25,16.75 270 top
D2  18.83,56.66 270 top
F2  13.15,23.66 90 top
H1  5,5 0 top
H2  95,5 0 top
H3  95,70 0 top
H4  5,70 0 top
J1  4.26,58.94 0 top
J2  38.25,68.25 180 top
J3  47.86,29.92 270 top
J4  5.5,16.75 0 top
J5  22.75,51.5 0 top
J6  11.75,30.25 0 top
J7  25.75,25.5 0 top
J8  12.25,68.25 0 top
J9  64,42.25 90 top
JP8  91.02,7.69 0 top
JP9  89.93,71.81 0 top
LED1  58.39,40.83 270 top
LED2  60.95,40.81 270 top
LED3  4.31,42.48 180 top
LED4  4.31,38.14 180 top
LED5  22.1,5.77 90 top
LED6  25.1,5.77 90 top
PL1  87.83,37.5 270 top
R1  20.25,42.03 270 top
R2  55.93,46.08 270 top
R3  31.45,70.19 270 top
R4  63.27,49.8 180 top
R5  59.95,46.05 270 top
R6  27.46,6.49 270 top
R7  29.5,71.25 270 top
R8  77.9,55.45 90 top
R9  76.3,55.4 90 top
R10  74.6,55.4 90 top
R11  73,55.35 90 top
R12  49.84,34.35 0 top
R13  66.05,57.9 180 top
R16  32.94,33.95 180 top
R17  49.79,36.24 0 top
R18  49.79,38.19 0 top
R19  47.51,46.54 270 top
R20  45.96,46.54 270 top
R21  13.51,16.15 0 top
R22  13.51,14.4 0 top
R23  8.94,41.56 270 top
R24  9.03,37.06 270 top
R25  69,56.4 180 top
R26  70.9,53.9 90 top
R27  69.3,53.1 90 top
R49  20.25,38.18 270 top
R52  29.6,6.46 270 top
R53  57.82,46.11 270 top
R54  35.56,54.94 90 top
R55  31.87,54.94 90 top
R56  29.93,54.94 90 top
R57  33.65,54.93 90 top
R58  27.54,57.82 270 top
R59  30.75,30.75 90 top
R60  28.5,31.75 90 top
S1  20.28,68.67 90 top
U1  54.07,54.96 0 top
U2  70.85,66.8 90 top
U4  73.75,43.5 90 top
U5  73.75,26 90 top
U6  50.72,68.18 0 top
U7  21,16 180 top
U8  39.92,39.14 90 top
U9  14.98,37 180 top
U10  19.78,30.46 180 top
U11  26.25,69 90 top
Y2  42.85,53.03 180 top

### Tracks (layer width: path | path; a pad name or v marks a point on that pad's centre or on a via)
3.3V  (via drill 0.38)
  Top 0.127: 30.95,28.45 30.82,28.57 | R59.1 30.75,28.65 30.82,28.57 | 30.82,28.57 36.12,28.57 36.25,28.45
  Top 0.178: C15.1 23.79,29.21 23.84,29.16
  Top 0.2: J3.4 47.13,36.13 48.25,37.25 50.5,37.25 50.64,37.39 R18.2 R17.2 50.69,36.19 R12.2
  Top 0.254: R24.2 9.03,28.53 9,28.5 10.2,27.3 20.05,27.3 20.75,28 20.73,28.02 U10.5 | R16.2 32.09,33.41 33,32.5 35.75,32.5 36.5,31.75 36.5,28.45
  Top 0.406: 47.13,31.72 J3.4 | U8.8 38.8,42.95 41,40.75 v41,38.5 | v41.05,35.85 41.05,35.7 41.42,35.33 U8.1 42.75,35.3 C19.1 | J7.1 25.83,25.58 C21.+
  Top 0.508: 47.13,31.72 44.3,34.55 C19.1
  Top 0.61: U10.5 23.84,29.16 24,29 25.45,29 C21.+ 26.76,28.45 30.95,28.45 36.25,28.45 36.5,28.45 45.95,28.45 47.15,29.65 47.15,30.9 J3.4
  Bottom 0.406: v41,38.5 41,35.85 41.02,35.83 v41.05,35.85
3.3V_F
  Top 0.305: C20.1 18.04,12.31 U7.17
5V  (via drill 0.35, 0.38)
  Top 0.127: v54.25,52.5 54,52.5 | v61.8,70.9 61.83,70.9 61.85,70.92
  Top 0.178: 73,18.5 73,18.1 C7.2 | U4.20 68.76,37.75 69.5,37.75 | R6.1 29.57,7.34 R52.1
  Top 0.254: U1.38 55,60.89 55,63.26 C2.2 55.92,63.67 | C9.2 45.88,56.02 46.14,55.76 U1.5 49.41,55.76 49.58,55.92 | U1.17 54.07,49.25 54.07,50.43 54,50.5 | 53.83,55.92 54,55.75 | U10.1 20.73,31.13 20.15,30.55 19.45,30.55 18.83,31.17 U10.3 | R23.2 11.15,38.5 14.98,38.5 | R58.1 27.54,60 25.75,60 | 50.04,69.75 U6.5 | R6.1 26,8.8 26,16.75 25.15,17.6 24.73,18.02 23.27,18.02 | U11.4 25.23,67.02 25.75,66.5 v25.75,62.95
  Top 0.305: 55.92,63.67 56.25,64 v56.55,64 | v50.75,69.75 50.04,69.75 | 54,57.5 54.4,57.5 | C8.2 54.06,49.24 54.07,49.25
  Top 0.406: 64.12,49.66 R4.1 v65.1,49.8 | 54.87,58.37 U1.38 | U9.2 14.98,38.5 U9.4 | U9.4 17.92,34.08 18.83,33.17 U10.3 16.97,31.76 C13.1 | 14.98,31.52 15,31.5 | U8.14 26.08,35.33 26,35.25 | 69.76,20 71.76,18 C7.2 | C22.2 71.75,35.5 69.5,37.75 71.25,37.75 v72,37 73.25,35.75 | 73,18.5 v71.5,20 70.55,20 70.5,20.05 68.96,20.05 U5.20 | R49.2 20.25,35.25 | 14.98,33.48 U9.4 | U7.4 23.27,18.02 22.75,17.5 | C23.1 25.15,17.6 | 67.67,72.72 U2.21
  Top 0.508: U9.4 14.98,31.52 | 15,31.5 v15,28 | v15,26.65 15.85,26.65 17.75,24.75 17.75,22 17.25,21.5 16.5,21.5 16,21 16,18.5 17,17.5 22.75,17.5
  Top 0.61: 54,50.5 54,52.5 54,55.75 54,57.5 54.87,58.37 | 49.58,55.92 53.83,55.92 | J2.2 40.79,64.29 39.5,63 v38.75,63 | v25.75,62.95 25.75,60 | 54.4,57.5 54.4,51.75 | J6.1 14.98,33.48 | 66.85,73.55 67.67,72.72 | C6.2 81.25,73 | C5.2 61.76,70.94 v61.8,70.9 | v60.1,70.9 60.08,70.92 59.85,70.92
  Top 0.813: C5.2 63.17,73.55 66.85,73.55 80.7,73.55 81.25,73 | 59.85,70.92 61.85,70.92
  Top 1.016: U9.4 17.33,34.08 18.5,35.25 20.25,35.25 24,35.25 | 24,35.25 26,35.25 28.25,37.5 v28.25,48.05 v28.25,50.45 28.25,51.25 25.75,53.75 25.75,60 | C12.+ 24,35.25 | v55.5,52.5 54,52.5 v53.25,52.5 | v29,49.25 v27.5,49.25
  Bottom 0.127: v72,37 71.5,37
  Bottom 0.254: 50.8,69.75 v50.75,69.75
  Bottom 0.508: v15,28 v15,26.65
  Bottom 0.61: v38.75,63 38.7,62.95 v25.75,62.95 | 66,52.39 66.9,53.29 | 50.25,51.5 50.25,51.9 49.7,52.45 | v60.1,70.9 60.05,70.85 60,70.85 | 68.42,51.08 67.15,49.8 v65.1,49.8
  Bottom 0.813: 58.85,65.1 60,66.25 60,70.85 51.85,70.85 v50.75,69.75 | 58.85,65.1 57.75,64 v56.55,64 | 66.9,53.29 66.9,55.75 58.85,63.8 58.85,65.1 | v60.1,70.9 v61.8,70.9
  Bottom 1.016: v55.5,52.5 55.45,52.45 49.7,52.45 47.7,50.45 v28.25,50.45 | v55.5,52.5 56,52.5 | 50.25,51.5 48,49.25 v29,49.25 | 45.95,48.05 v28.25,48.05 | 71.5,37 71.5,48 68.42,51.08 67.11,52.39 66,52.39 55.61,52.39 v55.5,52.5 | 71.55,36.95 71.5,36.95 v71.5,20
  pour Top (isolate 0.254): 27.3,52.5 26.8,52 26.8,37.3 26.25,36.75 25.5,36 17.75,36 17,35.25 17,33.5 17.5,33 18.25,33 18.5,33 19.75,34.25 26.5,34.25 30.5,38.25 30.5,51.5 29.5,52.5
  pour Top: 69.5,38 71.25,38 73.25,36 73.25,35.5 71.75,35.5 69.5,37.75
  pour Top: 71.5,20.5 73,19 73,18 72.75,17.75 71.75,17.75 69.25,20.25 69.75,20.5
  pour Top: 17,17.75 22.25,17.75 23,18.5 26.75,18.5 27.5,17.75 27.5,17.5 26.5,16.5 25.75,16.5 25,17.25 17,17.25
  pour Top: 53.5,53.25 53.5,57.25 55,58.75 55,52 54.25,51.25 53.75,51.25 53.5,51.5
  pour Bottom: 27,48.25 27.75,47.5 47.1,47.5 51.5,51.9 66.25,51.9 66.25,53 65.75,53.5 48.75,53.5 46.25,51 27.85,51 27,50.15
  pour Bottom: 72,37.75 72.5,37.25 72.5,36.75 72,36.25 71.75,36.25 71.25,36.75 71.25,37.25 71.75,37.75
  pour Bottom: 65.5,53.5 67,53.5 67.5,53 67.5,52.25 67.05,51.8 65.45,51.8 65.25,52 65.25,53.25
AREF
  Top 0.254: U1.29 arc90 U1.29 63.45,55.75 63.84,55.36 63.84,54.49 C1.1
AVCC
  Top 0.254: U1.27 62.15,54.16 | 62.15,54.16 62.27,54.28 C10.1 | R4.2 62.42,50.33 61.4,51.35 61.4,53.41 62.15,54.16
CLK_5V0
  Top 0.127: R56.1 29.93,53.32 31.25,52 31.25,40.35 35.7,35.9 38,35.9 38.4,36.3 38.4,37.2 37.7,37.9 37.67,37.87 U8.12
D+
  Top 0.178: R22.1 12.41,14.4 10.06,16.75 J4.D+
D-
  Top 0.178: R21.1 11.4,16.15 10,17.55 J4.D-
DC
  Top 0.127: U1.23 60,50.83 60,50.4 61.65,48.75 62.58,48.75 J9.3 65.25,46.08 65.25,34.3 67.83,31.71 U5.11
FT_D+
  Top 0.178: R22.2 14.76,14 16.25,14 16.77,13.47 U7.15
FT_D-
  Top 0.152: 14.41,16.1 R21.2
  Top 0.178: U7.16 17.43,14.03 15.35,16.1 14.41,16.1
FT_RXD
  Top 0.127: 31.02,27.48 55.73,27.48 58,29.75 58,34 47.5,44.5 47.05,44.5 45.96,45.59 R20.2
  Top 0.152: 31.02,27.48 25.05,21.5 23,21.5
  Top 0.178: U7.5 22.62,21.12 23,21.5
FT_TXD
  Top 0.127: R19.2 47.51,44.99 54.4,38.1 54.4,38.07 58.38,34.09 58.38,29.55 55.82,27 31.25,27
  Top 0.152: 25.9,21.64 31.25,27
  Top 0.178: U7.1 25.23,20.98 25.89,21.64 25.9,21.64
GND  (via drill 0.35, 0.38)  (2 unrouted)
  Top 0.127: v28.45,33.85 28.45,32.65 R60.2 | U1.28 60.01,55.1 61.25,55.1 61.45,55.3 62.95,55.3 63.15,55.1 63.15,51.3 63.1,51.25 | J4.S1 2.99,21.75 | 70.22,69.65 70.22,69.64 70.25,69.6 | v70.85,69.6 71.5,69.6 | v70.85,64.25 71,64.25 | v61.3,69.3 61.49,69.3 61.5,69.29 | U4.10 78.6,49.04 78.6,49 | v60.95,65.85 v60.96,65.84 61,65.84 | v57.95,65.85 v57.94,65.84 57.75,65.84 | 53.58,63.67 C2.1 53.48,63.67 53.45,63.7 | 56.85,57.7 56.15,58.4 v56.15,58.9 | 57.5,55 57.6,55.1 57.6,55.5 | v56.8,55 56.3,54.5 v56.1,54.5 | v77.1,31.7 77.05,31.7 | J2.6 35.61,65.3 35.61,64.75 | v23.4,32.2 23.4,33.35 | v35.95,8.75 35.97,8.77 | J4.S2 8.11,21.36 8.49,21.36 | v3,23.5 3,23.59 | v16.97,8.15 v16.98,8.16 17.09,8.16 | J4.S4 8.24,12.01 | J4.S3 2.26,12.01 2.24,12.01
  Top 0.152: U11.1 27.29,68.25 v29,68.25 30.09,69.34 R3.2
  Top 0.178: U1.6 48.71,54.96 48.85,55.1 | 57,55.25 56.88,55.38 56.8,55.3 v56.8,55 56.85,55 | 57.5,55.25 57.75,55 | 57.5,54.5 57.2,54.2 | U1.39 54,60.69 54,60.5 | v57.45,51.05 57.5,51.1 | v30.85,64.25 30.85,64.35 | v50.1,56.95 50.1,56.9 | v30.85,61.9 30.85,61.7 | R5.2 v59.95,44.15
  Top 0.254: v54.05,44.15 v54.06,44.16 C8.1 | U1.39 54.07,61.57 54.25,61.75 54.25,63 53.58,63.67 | U1.28 59.83,55 58.05,55 v58,55 | U1.18 54.87,50.87 54.9,50.9 54.9,50.95 v55,51.05 | C1.2 63.94,51.99 v63.2,51.25 63.1,51.25 62.5,51.85 62.5,52.55 C10.2 | 48.85,55.1 45.25,55.1 44.23,56.12 C9.1 43.13,56.12 v43.1,56.15 42.85,56.15 42.25,56.75 40.25,56.75 39.77,56.27 C3.1 39.67,55.7 39.67,55.02 v39.25,54.6 38.81,54.16 C4.1 | 54,60.5 v54,59 | 50.38,32.47 v50.35,32.5 | 42.2,30.99 J3.6 | C19.2 v46,36.35 | LED4.C LED3.C 2.81,49.55 v4.25,50.99 | v17.5,28.5 18,28 19.5,28 20,28.5 20,29.75 20.39,30.14 20.4,30.14 20.45,30.2 21.15,30.2 22,31.05 22,32.85 | v16.75,71.5 16.79,71.46 S1.2 S1.1 18.38,66 18.12,65.75 17.25,65.75 v16.75,65.75 | U6.3 51.67,65.92 51.52,65.77 v51.49,65.77 | U4.10 78.74,49.25 | C22.1 74.55,35.55 v74.55,36.6 | U7.7 21.32,18.38 v21.3,18.35 | U7.26 23.93,13.43 23.6,13.75 v23.55,13.75 23.27,13.47 U7.25 | U7.21 20.75,12.42 v20.75,13.75 | v18.47,13.72 v18.48,13.72 18.75,13.45 18.75,12.37 U7.18 | v59.65,39.31 59.63,39.33 LED1.C | LED2.C v62.4,39.3 | U2.18 71.48,69.6 70.25,69.6 | U2.20 68.85,71.23 68.85,69.7 v68.9,69.65 70.22,69.65 U2.19 | U2.17 72.75,69.6 71.5,69.6 70.95,69.6 | U2.16 74,71.3 v74,69.6 | v69,64.25 68.94,64.19 U2.5 | v72.75,64.25 72.7,64.2 72.7,62.33 U2.8 | U2.6 70.22,64.25 | U2.7 71.48,64.25
  Top 0.305: 53.45,63.7 v52.55,63.7 | v23,43 22.88,42.88 R1.1 | 17.09,8.16 C20.2 18.06,8.14 C16.2 20.39,8.14 21.32,9.07 v21.32,9.25 21.32,10.43 20.68,11.07 U7.21 | v19.15,21.7 20.75,21.7 21.35,21.1 21.35,19.68 U7.7 | U1.18 54.87,44.37 54.66,44.16 v54.06,44.16 | C23.2 v28.25,14.75 | C5.1 59.95,72.25 v59,72.25 | 60.1,73.2 60.1,72.25
  Top 0.406: v74.6,19.1 C7.1 | J3.3 50.38,32.47 | v42.2,32.55 42.2,30.99 | U8.7 42.67,43 v41,43 | U10.2 19.78,33.03 20.25,33.5 21.5,33.5 | v28.45,33.85 27.1,33.85 26.75,33.5 25.75,33.5 | 21.5,33.5 23.25,33.5 | 23.25,33.5 25.75,33.5 | 25.75,33.5 25.83,33.42 C21.- | C15.2 23.4,33.35 23.25,33.5 | C13.2 16.85,29.15 v17.5,28.5 | 22,32.85 22,33 21.5,33.5 | v2.99,23.49 v3,23.5 | v3,10.25 v2.99,10.24 v2.99,10.25 | v8.5,10.25 v8.49,10.24 | J2.6 35.61,65.5 v34,65.5 | v78.6,32.75 78.6,31.89 U5.10 | 78.74,49.25 v77.25,49.25 | J8.1 14.75,65.75 17.25,65.75 | C17.- 19.16,24.99 19.15,25 v19.15,25.1 | C17.- v20.75,23.4 | C17.- v19.16,21.71 v19.15,21.7 | 78.6,50.1 78.6,49 | 77.05,31.7 78.06,31.7 | v12.25,9.65 13.74,8.16 17.09,8.16 | 35.61,64.75 v34,64.75 | PL1.18 PL1.24 PL1.12 | 70.22,64.25 70,64.25 | v50,55 48.75,55 48.71,54.96 | 25.88,30.88 25.88,32.12
  Top 0.508: 12.27,9.61 12.25,9.59 | v59.45,61.1 59.45,60.29 58.16,59 v58.05,59 58.05,58.9 56.85,57.7 56.85,55 | 57.35,55.25 57.35,57.95 | 57.6,55.5 57.6,58.2
  Top 0.61: v32.25,8.75 32.27,8.77 J3.SH@2 35.97,8.77 | v65.25,10 65.17,9.92 J3.SH@1 60.86,9.92 | v55,51.05 56.55,51.05 57.2,51.7 57.2,54.2 57.2,54.9 | v58,55 57.5,54.5 57.5,51.1 57.5,51.05 55.95,51.05 | 57.75,55 57.5,55 v56.8,55 | 58.05,55 57.8,55.25 57.5,55.25 57.35,55.25 57,55.25 | 50.1,56.9 52.85,56.9 | v70.3,34.1 v72.85,34.1 74.2,34.1 74.6,34.5 C22.1 | v43.25,63 v43.25,59.75 | 30.85,61.7 30.85,64.35 | v36.85,51.75 v36.85,46.75 | J4.S4 J4.GND | v8.5,23.5 8.76,23.76 C11.2 10.73,24.87 10.7,24.9 10.7,25 v10.75,25.05 | v66.7,50.6 66.75,50.65 66.75,51.95 v68.1,53.3 68.1,54.45 v68.05,54.5 67.08,54.5 66.33,55.25 v65.2,55.25 | v50.1,56.95 50.1,58.9 v48.5,60.5 | 50.1,59 v54,59 | v57.45,51.05 57.95,51.05 v59.2,49.8 | v74,69.6 71.5,69.6 70.25,69.6 68.85,69.6 | v72.75,64.25 71.48,64.25 71,64.25 70,64.25 v69,64.25 | C6.1 v81.25,69 | v51.45,51.05 51.45,53.55 v50,55
  Top 0.813: 57.75,65.84 61,65.84 | 61.5,69.29 58.45,69.29 | 24.1,42.44 24.1,40.97 C12.- 24.23,41.1 v25.35,41.1 | v43.25,59.75 43.1,59.6 v43.1,56.15
  Top 1.016: 10.93,52.67 13.15,50.45 C14.- 13,46.3 13,44.25 v11.75,43 | 10.93,52.67 J1.P$4 J1.GND 4.26,52.99 4.25,53 v4.25,50.99 | v10.5,51 10.5,51.25 10.93,51.67 10.93,52.67 | 24.1,42.44 23.54,43 v23,43 | 2.99,21.75 v2.99,23.49 | v8.5,23.5 8.5,21.37 8.49,21.36 | 12.25,9.59 3.65,9.59 v2.99,10.25 | v3,10.25 3,11.25 2.24,12.01 | 8.24,12.01 8.24,10.51 v8.5,10.25 | 3,23.59 8.95,23.59
  Bottom 0.127: 56.75,55 56.6,55 v56.1,54.5 56.1,58.9 56,59 | v77.1,31.7 77.3,31.5 77.3,31.45 | v50.1,56.95 v50.1,58 v50.1,58.95 48.55,60.5 v48.5,60.5
  Bottom 0.178: PL1.12 85.63,25.62 79.05,19.05 74.65,19.05 v74.6,19.1 74.6,28.75 77.3,31.45 v78.6,32.75 | 77.75,33 74.4,33 73.3,34.1 v72.85,34.1 | v70.3,34.1 67.6,34.1 v62.4,39.3 | 62.35,51.3 57.7,51.3 v57.45,51.05 | v50,55 50,56.85 v50.1,56.95 | v52.9,56.95 54,58.05 v54,59 56,59 v58.05,59 | v77.25,49.25 77.35,49.15 | 54.05,50.55 v54.05,44.15 | v59.95,44.15 59.65,43.85 v59.65,39.31
  Bottom 0.254: 56.75,55 v58,55 | 54.05,50.55 54.55,51.05 v55,51.05 v51.45,51.05 51.35,50.95 51.35,50.1 48,46.75 v36.85,46.75 36.85,46.65 41,42.5 | v63.2,51.25 63.15,51.3 62.35,51.3 | v74.6,19.1 74.65,19.1 74.8,18.95 74.34,18.95 69.5,14.11 | v50.35,32.5 46,32.5 46,32.55 | 46,32.55 v42.2,32.55 41.05,33.7 28.6,33.7 v28.45,33.85 | 46,32.55 v46,36.35 46,38 v41,43 | v16.75,71.5 v16.75,65.75 26.5,65.75 v29,68.25 29,66.1 v30.85,64.25 | v52.55,63.7 52.55,64.15 51.49,65.21 v51.49,65.77 49.25,68.01 49.25,70.5 51.05,72.3 58.95,72.3 v59,72.25 | v78.6,32.75 78,32.75 77.75,33 | v39.25,54.6 36.85,52.2 v36.85,51.75 | v21.95,32.7 23,33.75 v23,43 | v21.95,32.7 23.1,33.85 v28.45,33.85 | v21.95,32.7 21.7,32.7 v17.5,28.5 15.67,26.67 15.67,25.87 14.78,24.97 13.3,23.5 v8.5,23.5 v3,23.5 | v3,10.25 8.25,10.25 v8.5,10.25 9.1,9.65 | v12.25,9.65 12.75,9.15 | v32.25,8.75 v30.25,8.75 | 28.45,23.45 v28.45,33.85 | v65.25,10 69.36,14.11 69.5,14.11 | 69.5,14.11 PL1.G1 | v43.25,59.75 43.25,59.7 | v43.25,63 43.25,63.25 41,65.5 v34,65.5 | v21.3,18.35 21.35,18.35 23.55,16.15 v23.55,13.75 v20.75,13.75 18.5,13.75 v18.47,13.72 | v21.32,9.25 29.75,9.25 v30.25,8.75 | v28.25,14.75 28.25,10.75 v30.25,8.75 | v74,69.6 72.75,69.6 68.95,69.6 v68.9,69.65
  Bottom 0.305: v21.32,9.25 20.22,8.15 16.9,8.15 | v59,72.25 59,72.3
  Bottom 0.406: 41,42.5 v41,43 | v12.25,9.65 9.1,9.65 | v3,23.5 1.75,22.25 1.75,11.5 v3,10.25 | v8.5,23.5 v8.5,10.25 | v34,65.5 31.25,68.25 v29,68.25 | v62.4,39.3 v62.39,39.31 v59.65,39.31 | PL1.G1 87.83,25.42 | 87.83,25.42 87.83,25.62 | 87.75,25.5 87.83,25.42 | v19.15,25.1 15.25,25.1 14.9,25.1 14.78,24.97 | 28.45,23.45 20.8,23.45 v20.75,23.4 | v63.2,51.25 63.43,51.48 65.82,51.48 v66.7,50.6
  Bottom 0.61: v32.25,8.75 61,8.75 | 61,8.75 64,8.75 v65.25,10 | v10.75,25.05 15.2,25.05 15.25,25.1 | PL1.G 87.83,62.42 v81.25,69 80.65,69.6 v74,69.6 | v59,72.25 62,72.25 63,71.25 63,70 62.65,69.65 | v72.75,64.25 72.75,69.6 | v68.9,69.65 62.65,69.65 | 62.65,69.65 62.3,69.3 v61.3,69.3 61.3,66.2 v60.95,65.85 | v60.85,9.9 60.85,8.9 61,8.75 | v57.95,65.85 57.95,68.55 v58.7,69.3 | PL1.18 PL1.19 PL1.20 PL1.21 PL1.22 PL1.23 PL1.24 87.88,25.62 87.75,25.5 | 87.83,25.62 PL1.12 | v78.6,50.05 77.8,49.25 v77.25,49.25 74.55,46.55 v74.55,36.6 | v54,59 v52.35,59
  Bottom 0.813: PL1.G1 95,6.94 H2.P1 | PL1.G 95,68.06 H3.P1 | H4.P1 6.75,68.25 J8.1 | H1.P1 8.25,8.25 8.25,10.25
  Bottom 1.016: v4.25,50.99 v10.49,50.99 v10.5,51 | v11.75,43 v23,43
  other vias: 25.9,30.95 60.05,73.15
  pour Bottom (isolate 0.254, rank 2): 0.5,74.5 0.5,0.5 99.5,0.5 99.5,74.5
  pour Top: 49.75,56.75 49.75,59.25 50,59.5 53.75,59.5 54.25,59 54.25,58.65 53.1,57.5 53.1,56.85 52.75,56.5 50,56.5
  pour Top: 58,59.5 56,59.5 55.5,59 55.5,53.7 56.25,52.95 56.25,52 55,50.75 55,50.5 58,50.5 58.5,51 58.5,59
GPIB_ATN  (via drill 0.38)
  Top 0.152: U5.8 80.42,29.18 v81,29.75
  Bottom 0.152: v81,29.75 82,29.75 83.97,27.79 PL1.11
GPIB_D1  (via drill 0.35)
  Top 0.127: U2.23 65.14,67.27 66.4,66 76.55,66 83.15,59.4 v83.15,51.08 | 81.11,39.05 84,41.95 84,43.5 84.5,44 86.05,44
  Top 0.152: PL1.1 87.5,47.55 87.5,44.5 87,44 86.05,44 | U4.2 81.11,39.05
  Bottom 0.127: v83.15,51.08 83.15,50.55 84.33,49.37 PL1.1
GPIB_D2  (via drill 0.35)
  Top 0.127: U2.24 63.87,67.89 66.05,65.7 76.45,65.7 82.4,59.75 v82.4,50.6 | PL1.2 84.97,47.22 84,46.25 84,44 83.5,43.5 83.5,42 81.75,40.25 78.85,40.25
  Top 0.152: 78.85,40.25 U4.3
  Bottom 0.127: v82.4,50.6 82.4,49.05 84.23,47.22 PL1.2
GPIB_D3  (via drill 0.38)
  Top 0.127: U2.1 64,62.14 64,60.9 64.95,59.95 75.8,59.95 78.75,57 78.75,54 75.4,50.65 75.4,43.1 77,41.5 78.68,41.5 U4.4 82.4,41.6 83.15,42.35 83.15,45.1 v83.35,45.3
  Bottom 0.152: PL1.3 83.59,45.06 v83.35,45.3
GPIB_D4  (via drill 0.38)
  Top 0.127: U2.2 65.14,61.27 66.15,60.25 76.1,60.25 79.2,57.15 79.2,53.88 75.8,50.48 75.8,43.35 76.3,42.85 78.76,42.85 U4.5 | v82.5,42.95 78.86,42.95 78.81,42.89
  Top 0.152: 78.81,42.89 U4.5
  Bottom 0.152: PL1.4 85.57,43 82.55,43 v82.5,42.95
GPIB_D5  (via drill 0.38)
  Top 0.127: U2.11 76.75,62.09 76.75,60.25 79.6,57.4 79.6,53.75 76.2,50.35 76.2,44.55 76.61,44.13 U4.6 82.03,44.13 82.75,44.85 82.75,45.65 v83.33,46.22
  Bottom 0.152: v83.33,46.22 87.17,46.22 87.75,46.8 87.75,48 89,49.25 89.86,49.25 PL1.13
GPIB_D6  (via drill 0.38)
  Top 0.127: U2.12 77.83,59.87 80.05,57.65 80.05,53.65 76.55,50.15 76.55,45.88 77,45.43 78.75,45.43 U4.7 78.88,45.3 v82.05,45.3
  Bottom 0.152: v82.05,45.3 82.45,45.3 83.75,44 87.5,44 88,44.5 88,45.75 89.47,47.22 PL1.14
GPIB_D7  (via drill 0.35)
  Top 0.127: U2.13 77.83,65.72 84.25,59.3 84.25,52.05 84.75,51.55 91.75,51.55 93.2,50.1 v93.2,45.06
  Top 0.152: U4.8 80.42,46.67 84.5,50.75 91.5,50.75 92.25,50 92.25,46 91.31,45.06 PL1.15
  Bottom 0.152: v93.2,45.06 PL1.15
GPIB_D8
  Top 0.127: U2.14 76.56,66.48 83.75,59.3 83.75,51.45 83.95,51.25 83.95,51.2 83.95,50.97 80.98,47.99
  Top 0.152: 80.98,47.99 78.83,47.99 U4.9 | 83.95,51.2 91.56,51.2 92.6,50.15 92.6,44.1 91.4,42.9 PL1.16
GPIB_DAV
  Top 0.152: U5.6 80.39,26.64 82.25,28.5 82.25,36.75 84,38.5 85.59,38.5 PL1.6
GPIB_EOI
  Top 0.152: U5.7 80.41,27.91 81.75,29.25 81.75,37.5 84.99,40.74 PL1.5
GPIB_IFC
  Top 0.152: U5.3 78.85,22.75 80,22.75 83.8,26.55 83.8,31.55 84.35,32.1 PL1.9
GPIB_NDAC
  Top 0.152: U5.4 78.87,24 80,24 83.25,27.25 83.25,33.5 84,34.25 PL1.8
GPIB_NRFD
  Top 0.152: U5.5 80.36,25.36 82.75,27.75 82.75,35.75 83.42,36.42 PL1.7
GPIB_REN
  Top 0.152: U5.2 78.73,21.5 77.75,21.5 76.5,22.75 76.5,32.5 77.75,33.75 80.25,33.75 81,34.5 81,38 84.75,41.75 88.98,41.75 PL1.17
GPIB_SRQ  (via drill 0.38)
  Top 0.152: U5.9 80.69,30.45 v81,30.75
  Bottom 0.152: v81,30.75 83.25,30.75 84.06,29.94 PL1.10
HC595_RCLK
  Top 0.127: U1.42 51.77,60.86 51.77,63.87 52.65,64.75 64.86,64.75 65.8,63.8
  Top 0.15: 65.8,63.8 65.8,61.15 66.36,60.59 73.09,60.59 74.25,61.75 74.03,61.98 U2.9
MISO  (via drill 0.38)
  Top 0.127: 31.75,61.2 31.75,55.91 R55.2 | J2.1 40.79,70.04 38.75,68 33.75,68 31.75,66 31.75,61.2 | U1.2 48.18,58.25 47,58.25 45.1,60.15 v45.1,61.05 | v37.27,61.2 31.75,61.2
  Bottom 0.127: v45.1,61.05 37.75,61.05 37.6,61.2 v37.28,61.2 v37.27,61.2
MISO_5V
  Top 0.127: U8.13 35.9,36.6 31.8,40.7 31.8,54.02 R55.1
MOSI  (via drill 0.38)
  Top 0.127: R57.2 33.65,56.15 37.75,60.25 | 37.75,60.25 38,60.5 38,65.15 | U1.1 47.02,58.96 45.88,60.1 45.88,60.52 v45.8,60.6 | 37.75,60.25 37.15,60.25 v36.9,60.5 | 49,71.5 47.2,69.7 42.1,69.7 38.25,65.85 J2.4 | 63.55,72.9 66.1,72.9 66.41,72.59 U2.22
  Top 0.15: 63.55,72.9 63.25,72.6 63.25,69 62.25,68 55.5,68 52,71.5 49,71.5
  Top 0.178: J2.4 38,65.15
  Bottom 0.127: v45.8,60.6 45.8,60.55 36.95,60.55 v36.9,60.5
MOSI_5V0
  Top 0.127: R57.1 33.65,53.25 32.35,51.95 32.35,42.55 35.8,39.1 37.08,39.1 U8.11
N$1
  Top 0.406: R1.2 R49.1 20.22,39 18.25,39 17.25,40 U9.1
N$2
  Top 0.178: R53.1 57.53,47.25 57.25,47.25 56.5,48 56.5,49.13 U1.20
N$3
  Top 0.254: U1.8 46.76,53.36 46.15,52.75 43,52.75 42.13,51.88 Y2.3 C4.2
N$4
  Top 0.254: U1.7 44.72,54.16 Y2.1 44.13,54.75 42.87,54.75 41.82,55.8 C3.2
N$5
  Top 0.178: R52.2 29.6,5.1 28.77,4.27 LED6.A
N$6
  Top 0.127: U6.4 52.27,69.48 54.82,66.93 63.77,66.93
  Top 0.15: U2.4 67.67,63.02 63.77,66.93
N$7
  Top 0.254: R23.1 8.87,42.48 LED3.A
N$8
  Top 0.152: U11.3 25.25,69.98 25.25,71 24.75,71.5 22.22,71.5 S1.4 S1.3
N$9
  Top 0.178: R6.2 23.47,5.64 LED5.A
N$12
  Top 0.152: U11.2 27.7,70.4 R7.2 29.6,70.5 30.25,70.5 30.79,71.04 R3.1
N$19
  Top 0.254: R24.1 8.8,38.14 LED4.A
N$21
  Top 0.178: R2.2 55.93,44.78 LED1.A
N$22
  Top 0.178: LED2.A 57.99,45.26 R53.2
N$28
  Top 0.178: R2.1 55.67,47.19 U1.19
NRESET  (via drill 0.38)
  Top 0.127: v44,70.36 44,71.5 42.25,73.25 37,73.25 35.71,71.96 J2.5 | v44,68.75 44,59.6 47.05,56.55 U1.4
  Top 0.152: R7.1 30.4,73 33.5,73 35.4,71.1 J2.5
  Bottom 0.127: v44,70.36 v44,68.75
PA0
  Top 0.127: U1.37 55.67,62.17 57,63.5 59.4,63.5 63.3,59.6 74.6,59.6 R8.2
PA0_D1
  Top 0.127: U4.19 69.94,39.05 69.95,39.05 73.9,43 73.9,50.6 R8.1
PA1
  Top 0.127: U1.36 56.5,60.79 56.5,62.25 57.25,63 59.35,63 63.1,59.25 73.3,59.25 R9.2
PA1_D2
  Top 0.127: U4.18 68.8,40.25 70,40.25 73.4,43.65 73.4,51.65 R9.1
PA2
  Top 0.127: U1.35 57.27,61.98 57.25,62 57.75,62.5 59.4,62.5 62.95,58.95 71.9,58.95 R10.2
PA2_D3
  Top 0.127: U4.17 70.34,41.59 72.95,44.2 72.95,52.9 R10.1
PA3
  Top 0.127: U1.34 58.07,61.82 58.25,62 59.5,62 62.85,58.65 70.55,58.65 R11.2
PA3_D4
  Top 0.127: U4.16 70.17,42.87 72.5,45.2 72.5,54 R11.1
PA4
  Top 0.127: U1.33 61.34,58.96 62.4,57.9 R13.2
PA4_D5
  Top 0.127: R13.1 70.15,57.9 72.08,55.98 72.08,45.42 70.75,44.1 70.72,44.13 U4.15
PA5
  Top 0.127: R25.2 64.7,56.4 63.7,57.4 62.35,57.4 61.59,58.16 U1.32
PA5_D6
  Top 0.127: R25.1 70.8,56.4 71.75,55.45 71.75,46.25 70.91,45.41 U4.14
PA6
  Top 0.127: R26.2 70.15,55.5 67.5,55.5 66.9,56.1 64.45,56.1 63.55,57 62,57 61.63,57.37 U1.31
PA6_D7
  Top 0.127: R26.1 70.9,47.15 70.5,46.75 68.8,46.75 U4.13
PA7
  Top 0.127: U1.30 63.44,56.56 64.25,55.75 66.75,55.75 67.33,55.17 68.68,55.17 69.3,54.55 R27.2
PA7_D8
  Top 0.127: U4.12 69.93,47.95 70.25,48.26 70.25,50.75 69.3,51.7 R27.1
PB0_EOI  (via drill 0.38)
  Top 0.127: v53.59,62.26 53.27,61.94 U1.40 | v52.75,66.75 52.75,67.5 52.3,67.95 50.2,67.95 49.75,67.5 49.77,67.48 U6.1 | U5.14 69.91,27.91 70.75,28.75 70.75,31.45 69.45,32.75 67.45,32.75 65.65,34.55 65.65,50.8 65.8,50.95 65.8,54 v65.9,54
  Bottom 0.127: v65.9,54 66.2,54.3 66.2,55.5 61.82,59.88 55.35,59.88 53.59,61.64 v53.59,62.26 53.59,65.86 52.73,66.72 v52.75,66.75
PB1_DAV  (via drill 0.38)
  Top 0.127: v52.5,62.25 52.5,60.79 U1.41 | U5.15 69.89,26.64 71.1,27.85 71.1,31.55 69.4,33.25 67.5,33.25 66,34.75 66,50.65 66.15,50.8 66.15,53.3 66.5,53.65 66.5,54.15 66.1,54.55 65.36,54.55 v65.1,54.3
  Bottom 0.127: v52.5,62.25 55.2,59.55 61.75,59.55 65.9,55.4 65.9,54.85 65.35,54.3 v65.1,54.3
PB3_CS  (via drill 0.38)
  Top 0.127: R58.2 27.54,55.96 28.55,54.95 34.4,54.95 | 34.4,54.95 34.45,54.95 34.6,54.8 34.6,41.65 35.84,40.41 U8.10 | 34.4,54.95 34.6,55.15 34.6,56.27 40.59,62.26 v41.8,62.26 | U1.43 50.75,60.88 50.75,61.6 50.11,62.24 v45.09,62.24
  Bottom 0.127: v41.8,62.26 41.78,62.24 v45.09,62.24
PB4_CD  (via drill 0.38)
  Top 0.127: U1.44 49.97,60.76 49.12,61.62 49.1,61.6 v45.8,61.6 | R54.2 35.5,55.85 35.5,56.25 40.9,61.65 v42.35,61.65
  Bottom 0.127: v45.8,61.6 42.4,61.6 v42.35,61.65
PD2_NRFD
  Top 0.127: U1.11 49.45,49.78 49.45,44.1 59.05,34.5 59.05,30.7 64.25,25.5 68.59,25.5 U5.16
PD3_NDAC  (via drill 0.38)
  Top 0.127: U5.17 v65.25,24.1 | U1.12 50.07,44.03 54.75,39.35 63.75,30.35 63.75,27.6 v65.2,26.15
  Bottom 0.127: v65.25,24.1 65.25,26.1 v65.2,26.15
PD4_IFC  (via drill 0.38)
  Top 0.127: v50.6,63.95 51.8,65.15 65,65.15 66.36,63.8 66.36,62.33 U2.3 | v66,23.5 66.67,22.82 U5.18 | v65.25,27 64.25,28 64.25,30.35 50.82,43.78 50.82,49.11 U1.13 50.87,50.12 51.25,50.5 51.75,50.5 52,50.75 v52,54.75
  Bottom 0.127: v52,54.75 51.05,55.7 51.05,63.5 v50.6,63.95 | v65.25,27 65.8,26.45 65.8,23.7 v66,23.5
PD5_SRQ  (via drill 0.38)
  Top 0.127: U5.12 68.67,30.5 v66.5,30.5 | v65.45,29.5 65.45,29.7 51.78,43.37 51.77,43.37 51.25,43.9 51.25,45 51.39,45.14 51.39,45.15 51.67,45.42 U1.14
  Bottom 0.127: v66.5,30.5 65.5,29.5 v65.45,29.5
PD6_ATN  (via drill 0.38)
  Top 0.127: U6.2 50.72,66.42 50.61,66.31 v50.61,64.9 | U5.13 66.53,29.18 51.8,43.91 51.75,43.91 51.75,45 52.47,45.72 U1.15 52.5,49.19 52.5,53.5 53,54 v53,54.75
  Bottom 0.127: v53,54.75 51.36,56.39 51.36,64.15 v50.61,64.9
PD7_REN  (via drill 0.38)
  Top 0.127: v52.45,44.6 52.5,44.6 53.27,45.37 U1.16 | v48.9,44.59 48.9,44.09 58.75,34.24 58.75,26.2 63.36,21.59 68.69,21.59 U5.19
  Bottom 0.127: v52.45,44.6 48.91,44.6 v48.9,44.59
PE  (via drill 0.38)
  Top 0.127: U1.22 60.34,49.16 64,45.5 | v66.55,44.81 66.55,48.3 67.47,49.22 U4.11
  Top 0.178: 64,45.5 J9.2
  Bottom 0.178: v66.55,44.81 66.5,44.76 64.03,44.76 J9.2
PWRIN1
  Top 1.016: J1.VIN0 7.65,61.25 16.52,61.25 D2.A
RXD
  Top 0.178: R19.1 46.62,46.5 46.58,46.5 46.57,46.51 45.35,46.51 45.34,46.5 45.25,46.5 44.75,47 44.75,48.5 46.5,50.25 46.5,52 47.06,52.56 U1.9
RXLED
  Top 0.178: LED5.C 22.1,10.3 21.32,11.07 U7.22
SCK  (via drill 0.38)
  Top 0.127: J2.3 38.2,71.05 | 38.2,71.05 37.75,70.6 37.75,69.75 36.5,68.5 33.5,68.5 29.93,64.93 R56.2 | U1.3 47.14,57.36 44.5,60 44.5,66.25 46.5,68.25 47.6,69.35 43.41,69.35 v43.1,69.04 | 38.2,71.05 38.2,72.2 38.75,72.75 42,72.75 43.15,71.6 v43.15,70.4 | 75.3,64.9 74.84,65.36 65.85,65.36 63.71,67.5 55.2,67.5 51.7,71 49.25,71
  Top 0.15: 75.3,64.9 75.3,64.89 U2.10 | 46.5,68.25 49.25,71
  Bottom 0.127: v43.15,70.4 43.15,69.09 v43.1,69.04
SD_CD
  Top 0.127: J3.CD 48.99,31.03 R12.1 | 55.75,32.25 53,35 53,38.5 50.75,40.75 46.75,40.75 43.25,44.25 36.25,44.25 35.56,44.94 R54.1
  Top 0.15: J3.CD 48.88,29.87 49.5,29.25 55.25,29.25 55.75,29.75 55.75,32.25
SD_CLK
  Top 0.127: U8.3 42.57,37.72 41.12,37.72 38.9,35.5 38.9,29.85 39.5,29.25 43.75,29.25 44.63,30.13 J3.5
SD_CS
  Top 0.127: J3.1 54.63,32.62 52.5,34.75 52.5,38.5 50.6,40.4 44.58,40.4 44.57,40.41 U8.5
SD_DAT1
  Top 0.127: J3.8 38.01,31.99 36,34 34,34 33.92,34.08 R16.1
SD_DAT2
  Top 0.127: R17.1 48.49,36.24 48,35.75 48,29.5 48.75,28.75 56,28.75 57.25,30 57.13,30.12 J3.9
SD_MISO
  Top 0.127: J3.7 39.7,35.6 40.7,36.6 U8.2 43.57,36.6 45.16,38.19 R18.1
SD_MOSI
  Top 0.127: J3.2 52.13,38.37 51.35,39.15 44.9,39.15 44.89,39.14 U8.4
SD_WP
  Top 0.127: J3.WP 34.18,31.6 R59.2 29.85,31.6 29.15,30.9 R60.1
TE  (via drill 0.38)
  Top 0.127: U1.21 57.27,48.48 57.75,48 58.85,48 R5.1 61.6,46.9 62.75,45.75 62.75,42.75 63.25,42.25 J9.1 | U5.1 76.72,20.29 76,21 76,32 76,32.75 78.78,35.53 U4.1 | 66.5,39.25 66.5,42.27 v66.56,42.27
  Top 0.152: 66.5,39.25 66.5,34.75 67.66,33.59 69.6,33.59 71.19,32 76,32
  Bottom 0.178: v66.56,42.27 64,42.27 J9.1
TXD
  Top 0.127: R20.1 45.96,48.96 46.5,49.5 46.55,49.55 46.86,49.86
  Top 0.178: U1.10 47.26,51.76 46.86,51.36 46.86,49.86
TXLED
  Top 0.178: LED6.C 25.1,7.9 21.98,11.03 U7.23
USBVCC
  Top 0.305: C16.1 20.02,10.09 20.02,12 U7.20
  Top 0.406: C17.+ 15.25,22.29 15.25,18 20.02,13.22 20.02,12
  Top 0.813: F2.2 14.81,23.4 C17.+
VIN
  Top 0.813: J5.1 18.83,51.5
  Top 1.016: D2.C 18.83,51.5 18.83,49.08 17.95,48.2 C14.+ 12.75,41.25 12.75,40.08 U9.3
VUSB1
  Top 0.127: J4.VBUS
  Top 0.61: J4.VBUS 9,19.35 9.85,19.35 10.75,20.25 10.73,20.27 C11.1 12.95,22.06 F2.1

### Text on the board
tPlace: 1 | GND | ISP | VIN | 5V0 | 3V3 | HP85Disk Emulator-02 | Mike Gore | Jay Hamlin | RX | TX
Measures: Units in inches
214bmp: D:/SmartProjects/Snc/a4_bn_logo2.bmp